# EAGLE schematic smrf-v1.0.1b (EAGLE 7.3.0)

## Sheet 1 of 6
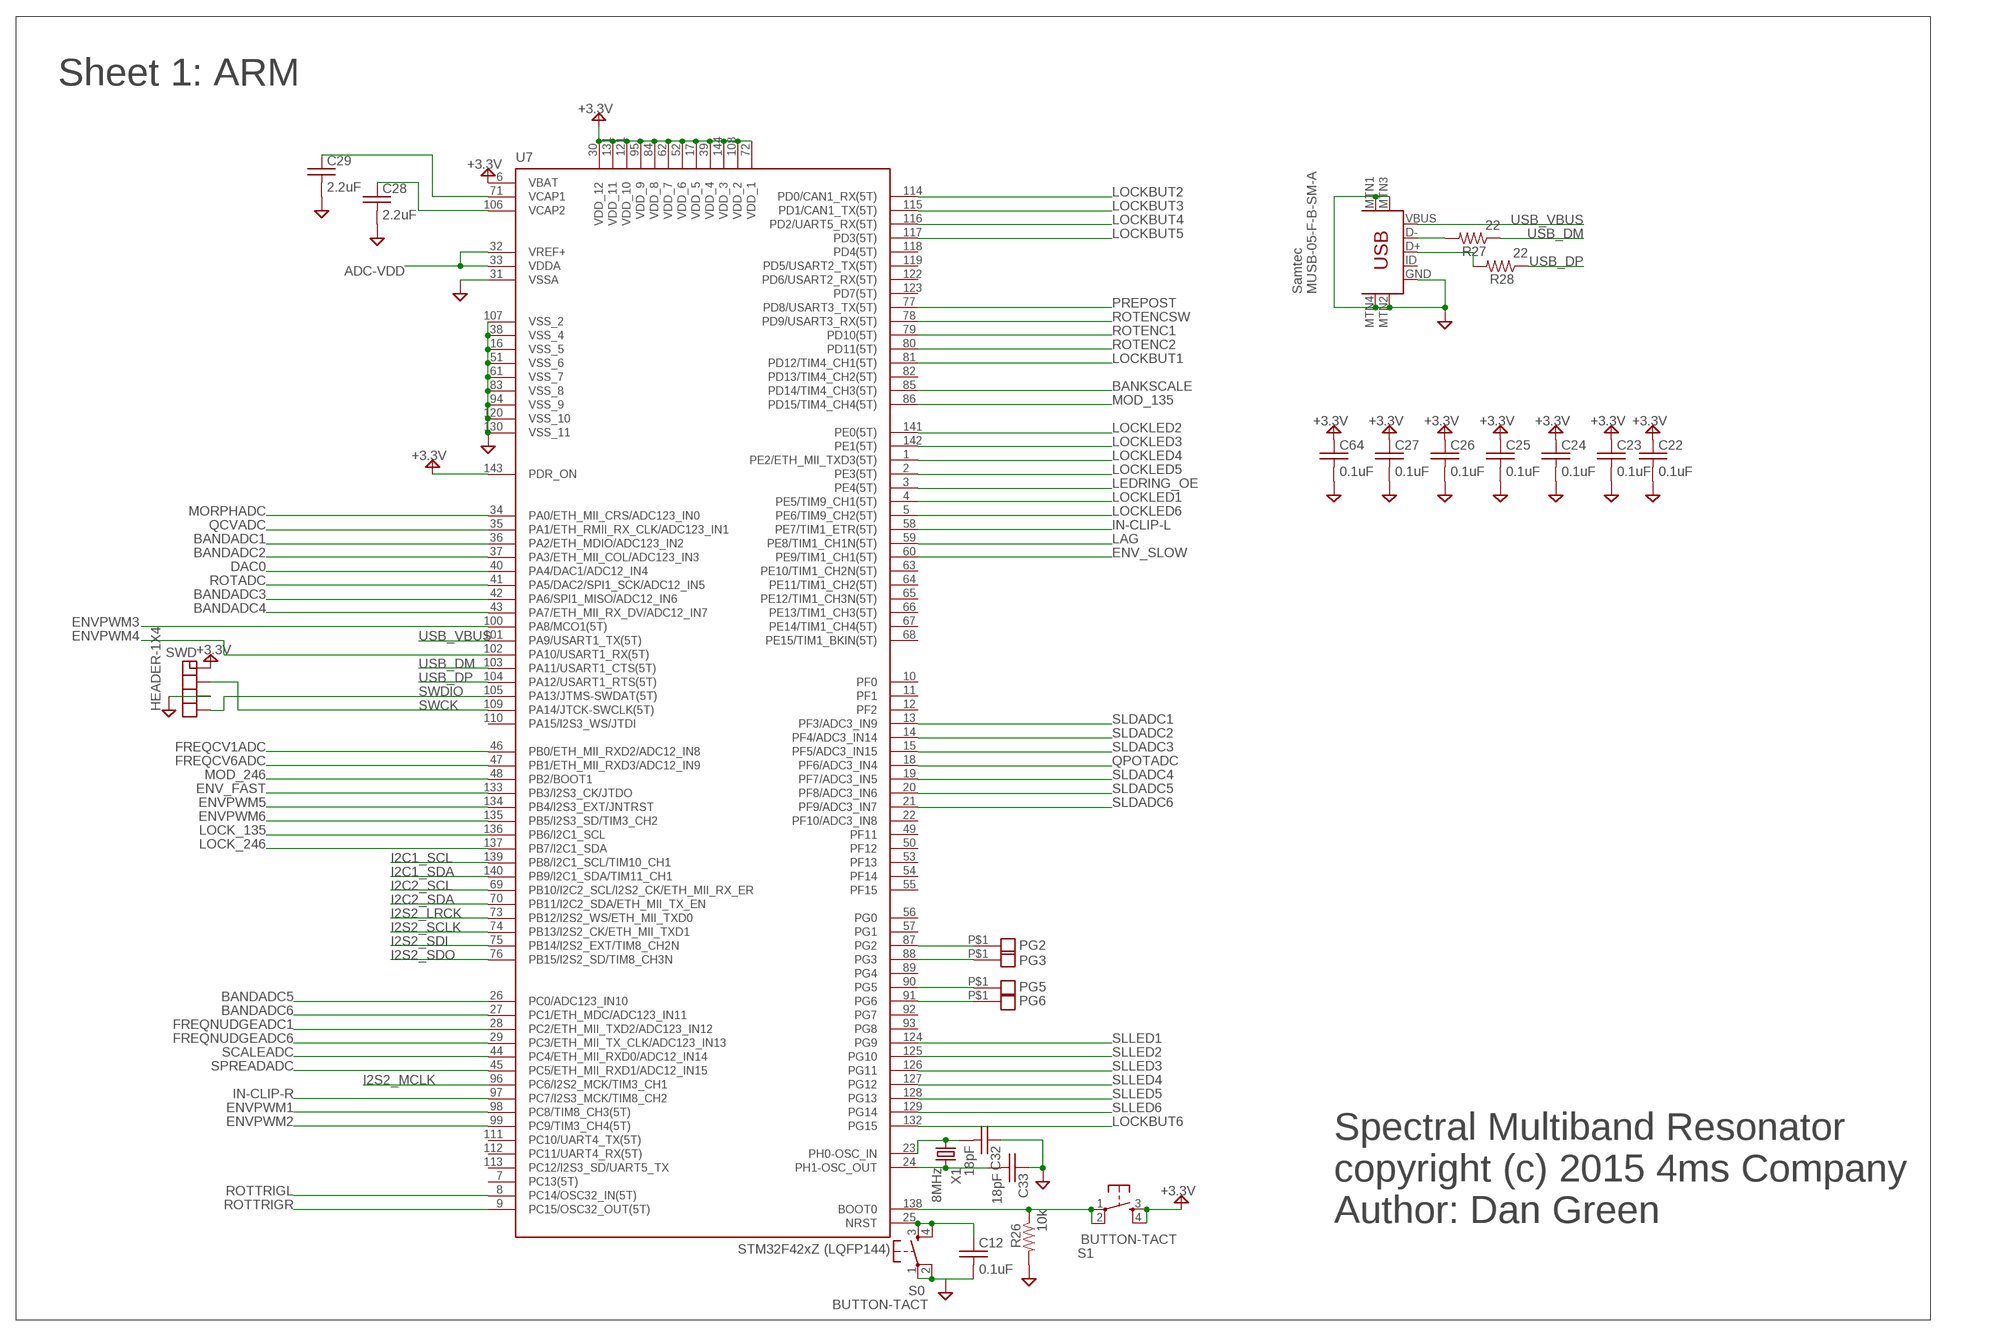
[diagram p0: schematic, sheet 1]

### Parts
C12  0.1uF  CB  [C0603]
C22  0.1uF  CB  [C0603]
C23  0.1uF  CB  [C0603]
C24  0.1uF  CB  [C0603]
C25  0.1uF  CB  [C0603]
C26  0.1uF  CB  [C0603]
C27  0.1uF  CB  [C0603]
C28  2.2uF  CB  [C0603]
C29  2.2uF  CB  [C0603]
C32  18pF  CB  [C0603]
C33  18pF  CB  [C0603]
C64  0.1uF  CB  [C0603]
PG2  PAD-06  [PAD-06]
PG3  PAD-06  [PAD-06]
PG5  PAD-06  [PAD-06]
PG6  PAD-06  [PAD-06]
R26  10k  RB  [R0603]
R27  22  RB  [R0603]
R28  22  RB  [R0603]
S0  BUTTON-TACT  [BUTTON-TACT-SKQG]
S1  BUTTON-TACT  [BUTTON-TACT-SKQG]
SWD  HEADER-1X4  [HEADER-1X4-TH]
U7  STM32F427ZG  STM32F429ZI  [LQFP144]
U$1  USB-MINIB-5PIN  [USB-MINIB]
X1  8MHz  CRYSTALD  [HC-49/US]

### Nets
+3.3V [power]: C22.1 C23.1 C24.1 C25.1 C26.1 C27.1 C64.1 S1.3 S1.4 SWD.P$1 U7.6(VBAT) U7.17(VDD_5) U7.30(VDD_12) U7.39(VDD_4) U7.52(VDD_6) U7.62(VDD_7) U7.72(VDD_1) U7.84(VDD_8) U7.95(VDD_9) U7.108(VDD_2) U7.121(VDD_10) U7.131(VDD_11) U7.143(PDR_ON) U7.144(VDD_3) ; also sheet 2,4,6
ADC-VDD [power]: U7.32(VREF+) U7.33(VDDA) ; also sheet 3,4,6
BANDADC1: U7.36(PA2/ETH_MDIO/ADC123_IN2) ; also sheet 3
BANDADC2: U7.37(PA3/ETH_MII_COL/ADC123_IN3) ; also sheet 3
BANDADC3: U7.42(PA6/SPI1_MISO/ADC12_IN6) ; also sheet 3
BANDADC4: U7.43(PA7/ETH_MII_RX_DV/ADC12_IN7) ; also sheet 3
BANDADC5: U7.26(PC0/ADC123_IN10) ; also sheet 3
BANDADC6: U7.27(PC1/ETH_MDC/ADC123_IN11) ; also sheet 3
BANKSCALE: U7.85(PD14/TIM4_CH3(5T)) ; also sheet 4
DAC0: U7.40(PA4/DAC1/ADC12_IN4) ; also sheet 2
ENV_FAST: U7.133(PB3/I2S3_CK/JTDO) ; also sheet 4
ENV_SLOW: U7.60(PE9/TIM1_CH1(5T)) ; also sheet 4
ENVPWM1: U7.98(PC8/TIM8_CH3(5T)) ; also sheet 3
ENVPWM2: U7.99(PC9/TIM3_CH4(5T)) ; also sheet 3
ENVPWM3: U7.100(PA8/MCO1(5T)) ; also sheet 3
ENVPWM4: U7.102(PA10/USART1_RX(5T)) ; also sheet 3
ENVPWM5: U7.134(PB4/I2S3_EXT/JNTRST) ; also sheet 3
ENVPWM6: U7.135(PB5/I2S3_SD/TIM3_CH2) ; also sheet 3
FREQCV1ADC: U7.46(PB0/ETH_MII_RXD2/ADC12_IN8) ; also sheet 4
FREQCV6ADC: U7.47(PB1/ETH_MII_RXD3/ADC12_IN9) ; also sheet 4
FREQNUDGEADC1: U7.28(PC2/ETH_MII_TXD2/ADC123_IN12) ; also sheet 4
FREQNUDGEADC6: U7.29(PC3/ETH_MII_TX_CLK/ADC123_IN13) ; also sheet 4
GND [power]: C12.2 C22.2 C23.2 C24.2 C25.2 C26.2 C27.2 C28.2 C29.2 C32.1 C33.1 C64.2 R26.2 S0.1 S0.2 SWD.P$3 U7.16(VSS_5) U7.31(VSSA) U7.38(VSS_4) U7.51(VSS_6) U7.61(VSS_7) U7.83(VSS_8) U7.94(VSS_9) U7.107(VSS_2) U7.120(VSS_10) U7.130(VSS_11) U$1.GND U$1.MTN1(MTN2) U$1.MTN2(MTN3) U$1.MTN3(MTN1) U$1.MTN4 ; also sheet 2,3,4,5,6
I2C1_SCL: U7.139(PB8/I2C1_SCL/TIM10_CH1) ; also sheet 5
I2C1_SDA: U7.140(PB9/I2C1_SDA/TIM11_CH1) ; also sheet 5
I2C2_SCL: U7.69(PB10/I2C2_SCL/I2S2_CK/ETH_MII_RX_ER) ; also sheet 2
I2C2_SDA: U7.70(PB11/I2C2_SDA/ETH_MII_TX_EN) ; also sheet 2
I2S2_LRCK: U7.73(PB12/I2S2_WS/ETH_MII_TXD0) ; also sheet 2
I2S2_MCLK: U7.96(PC6/I2S2_MCK/TIM3_CH1) ; also sheet 2
I2S2_SCLK: U7.74(PB13/I2S2_CK/ETH_MII_TXD1) ; also sheet 2
I2S2_SDI: U7.75(PB14/I2S2_EXT/TIM8_CH2N) ; also sheet 2
I2S2_SDO: U7.76(PB15/I2S2_SD/TIM8_CH3N) ; also sheet 2
IN-CLIP-L: U7.58(PE7/TIM1_ETR(5T)) ; also sheet 4
IN-CLIP-R: U7.97(PC7/I2S3_MCK/TIM8_CH2) ; also sheet 4
LAG: U7.59(PE8/TIM1_CH1N(5T)) ; also sheet 4
LEDRING_OE: U7.3(PE4(5T)) ; also sheet 5
LOCK_135: U7.136(PB6/I2C1_SCL) ; also sheet 4
LOCK_246: U7.137(PB7/I2C1_SDA) ; also sheet 4
LOCKBUT1: U7.81(PD12/TIM4_CH1(5T)) ; also sheet 3
LOCKBUT2: U7.114(PD0/CAN1_RX(5T)) ; also sheet 3
LOCKBUT3: U7.115(PD1/CAN1_TX(5T)) ; also sheet 3
LOCKBUT4: U7.116(PD2/UART5_RX(5T)) ; also sheet 3
LOCKBUT5: U7.117(PD3(5T)) ; also sheet 3
LOCKBUT6: U7.132(PG15) ; also sheet 3
LOCKLED1: U7.4(PE5/TIM9_CH1(5T)) ; also sheet 3
LOCKLED2: U7.141(PE0(5T)) ; also sheet 3
LOCKLED3: U7.142(PE1(5T)) ; also sheet 3
LOCKLED4: U7.1(PE2/ETH_MII_TXD3(5T)) ; also sheet 3
LOCKLED5: U7.2(PE3(5T)) ; also sheet 3
LOCKLED6: U7.5(PE6/TIM9_CH2(5T)) ; also sheet 3
MOD_135: U7.86(PD15/TIM4_CH4(5T)) ; also sheet 4
MOD_246: U7.48(PB2/BOOT1) ; also sheet 4
MORPHADC: U7.34(PA0/ETH_MII_CRS/ADC123_IN0) ; also sheet 4
N$12: R27.2 U$1.D-
N$13: R28.2 U$1.D+
N$14: C32.2 U7.23(PH0-OSC_IN) X1.1
N$38: C28.1 U7.106(VCAP2)
N$39: C29.1 U7.71(VCAP1)
N$40: R26.1 S1.1 S1.2 U7.138(BOOT0)
N$41: C33.2 U7.24(PH1-OSC_OUT) X1.2
N$53: PG2.P$1 U7.87(PG2)
N$96: PG3.P$1 U7.88(PG3)
N$223: PG6.P$1 U7.91(PG6)
N$224: PG5.P$1 U7.90(PG5)
NRST: C12.1 S0.3 S0.4 U7.25(NRST)
PREPOST: U7.77(PD8/USART3_TX(5T)) ; also sheet 4
QCVADC: U7.35(PA1/ETH_RMII_RX_CLK/ADC123_IN1) ; also sheet 4
QPOTADC: U7.18(PF6/ADC3_IN4) ; also sheet 4
ROTADC: U7.41(PA5/DAC2/SPI1_SCK/ADC12_IN5) ; also sheet 4
ROTENC1: U7.79(PD10(5T)) ; also sheet 4
ROTENC2: U7.80(PD11(5T)) ; also sheet 4
ROTENCSW: U7.78(PD9/USART3_RX(5T)) ; also sheet 4
ROTTRIGL: U7.8(PC14/OSC32_IN(5T)) ; also sheet 4
ROTTRIGR: U7.9(PC15/OSC32_OUT(5T)) ; also sheet 4
SCALEADC: U7.44(PC4/ETH_MII_RXD0/ADC12_IN14) ; also sheet 4
SLDADC1: U7.13(PF3/ADC3_IN9) ; also sheet 3
SLDADC2: U7.14(PF4/ADC3_IN14) ; also sheet 3
SLDADC3: U7.15(PF5/ADC3_IN15) ; also sheet 3
SLDADC4: U7.19(PF7/ADC3_IN5) ; also sheet 3
SLDADC5: U7.20(PF8/ADC3_IN6) ; also sheet 3
SLDADC6: U7.21(PF9/ADC3_IN7) ; also sheet 3
SLLED1: U7.124(PG9) ; also sheet 3
SLLED2: U7.125(PG10) ; also sheet 3
SLLED3: U7.126(PG11) ; also sheet 3
SLLED4: U7.127(PG12) ; also sheet 3
SLLED5: U7.128(PG13) ; also sheet 3
SLLED6: U7.129(PG14) ; also sheet 3
SPREADADC: U7.45(PC5/ETH_MII_RXD1/ADC12_IN15) ; also sheet 4
SWCK: SWD.P$2 U7.109(PA14/JTCK-SWCLK(5T))
SWDIO: SWD.P$4 U7.105(PA13/JTMS-SWDAT(5T))
USB_DM: R27.1 U7.103(PA11/USART1_CTS(5T))
USB_DP: R28.1 U7.104(PA12/USART1_RTS(5T))
USB_VBUS: U7.101(PA9/USART1_TX(5T)) U$1.VBUS
Unconnected: U7.7(PC13(5T)) U7.10(PF0) U7.11(PF1) U7.12(PF2) U7.22(PF10/ADC3_IN8) U7.49(PF11) U7.50(PF12) U7.53(PF13) U7.54(PF14) U7.55(PF15) U7.56(PG0) U7.57(PG1) U7.63(PE10/TIM1_CH2N(5T)) U7.64(PE11/TIM1_CH2(5T)) U7.65(PE12/TIM1_CH3N(5T)) U7.66(PE13/TIM1_CH3(5T)) U7.67(PE14/TIM1_CH4(5T)) U7.68(PE15/TIM1_BKIN(5T)) U7.82(PD13/TIM4_CH2(5T)) U7.89(PG4) U7.92(PG7) U7.93(PG8) U7.110(PA15/I2S3_WS/JTDI) U7.111(PC10/UART4_TX(5T)) U7.112(PC11/UART4_RX(5T)) U7.113(PC12/I2S3_SD/UART5_TX) U7.118(PD4(5T)) U7.119(PD5/USART2_TX(5T)) U7.122(PD6/USART2_RX(5T)) U7.123(PD7(5T)) U$1.ID

### Notes on the sheet
- Sheet 1: ARM
- Samtec 
  MUSB-05-F-B-SM-A
- Spectral Multiband Resonator
- copyright (c) 2015 4ms Company
  Author: Dan Green

## Sheet 2 of 6
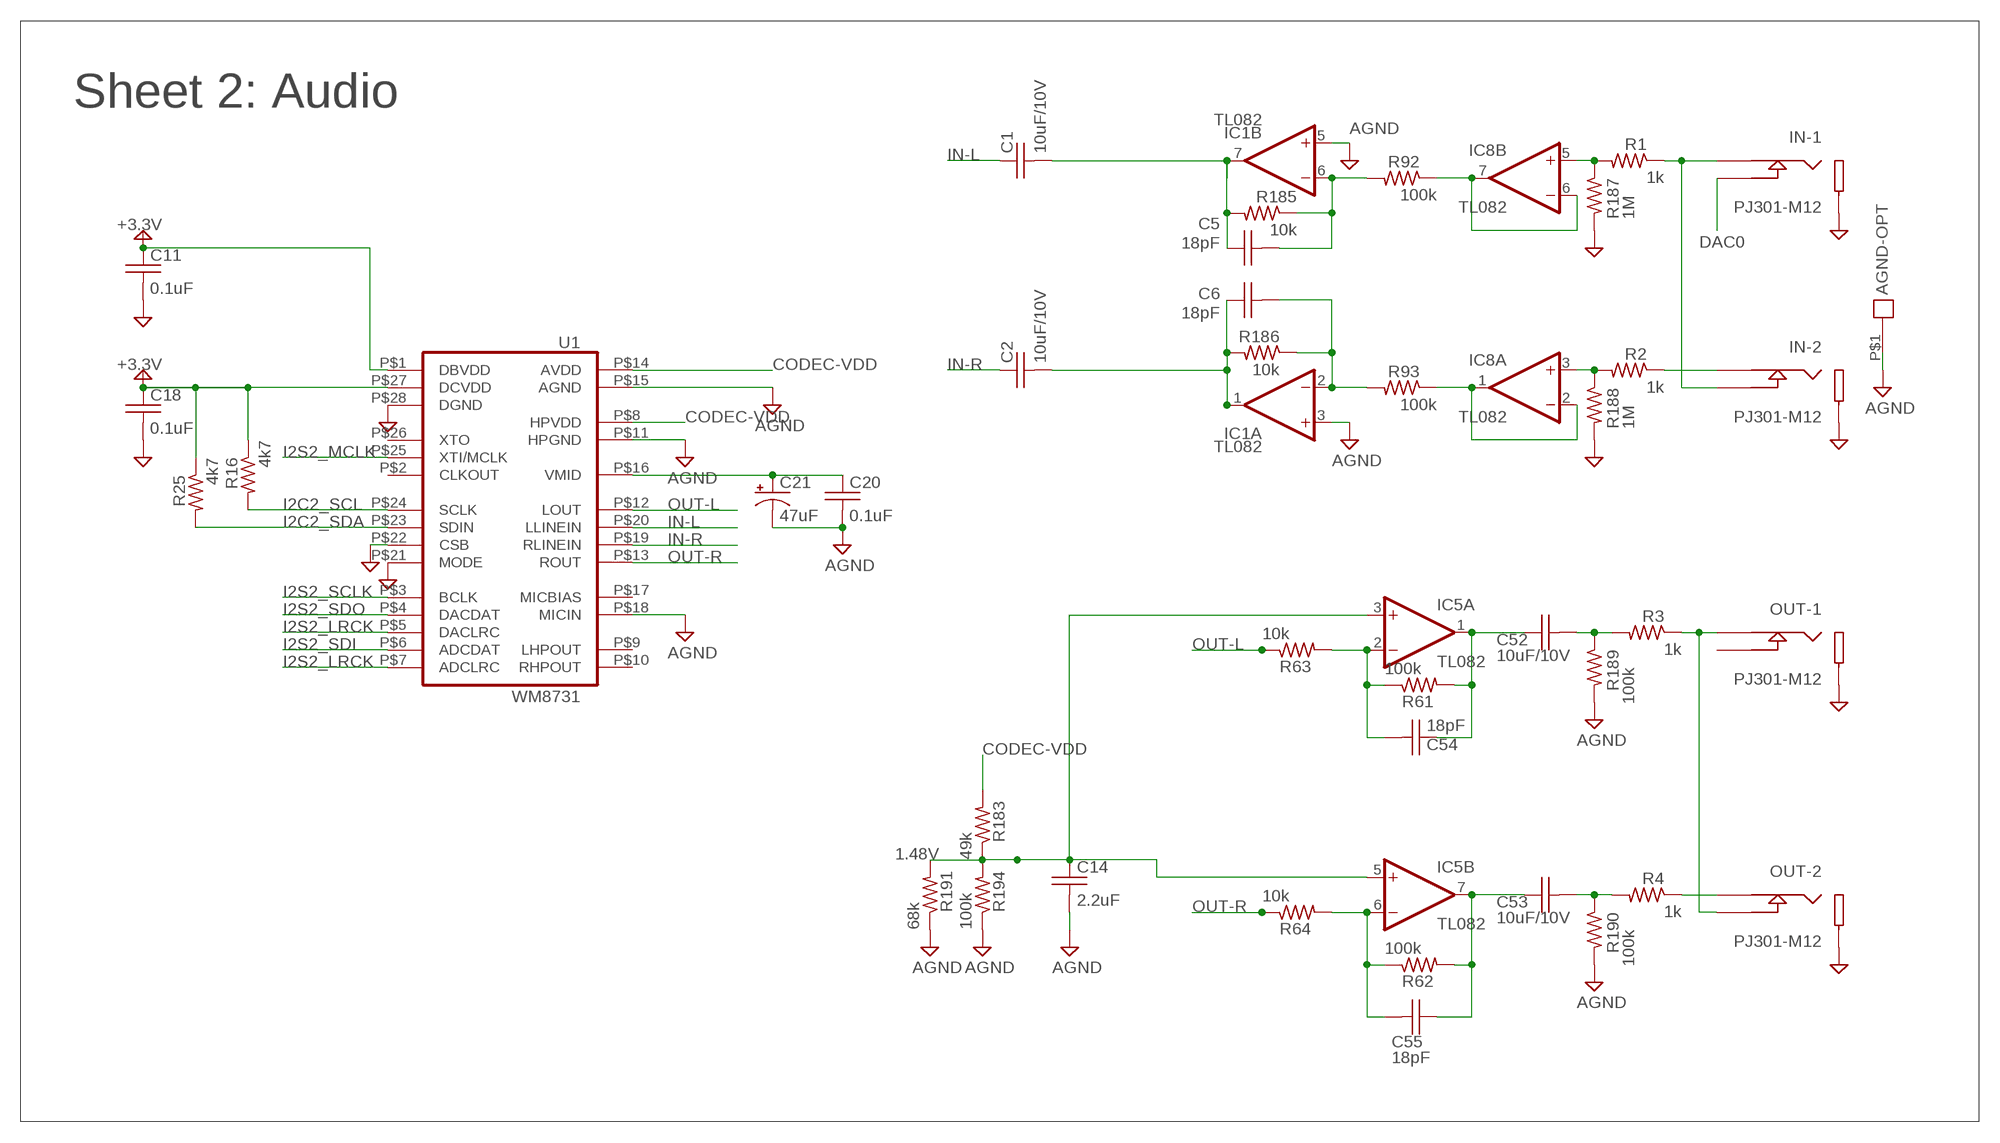
[diagram p1: schematic, sheet 2]

### Parts
AGND-OPT  PAD-06  [PAD-06]
C1  10uF/10V  CB  [C0603]
C2  10uF/10V  CB  [C0603]
C5  18pF  CB  [C0603]
C6  18pF  CB  [C0603]
C11  0.1uF  CB  [C0603]
C14  2.2uF  CB  [C0603]
C18  0.1uF  CB  [C0603]
C20  0.1uF  CB  [C0603]
C21  47uF  C-POL5  [C-POL-5]
C52  10uF/10V  CB  [C0603]
C53  10uF/10V  CB  [C0603]
C54  18pF  CB  [C0603]
C55  18pF  CB  [C0603]
IC1  TL082  OPAMP-2TL072T  [TSSOP8]
IC5  TL082  OPAMP-2TL072T  [TSSOP8]
IC8  TL082  OPAMP-2TL072T  [TSSOP8]
IN-1  PJ301-M12  JACK-MONO-SWM2  [PJ301M-12-FIX]
IN-2  PJ301-M12  JACK-MONO-SWM2  [PJ301M-12-FIX]
OUT-1  PJ301-M12  JACK-MONO-SWM2  [PJ301M-12-FIX]
OUT-2  PJ301-M12  JACK-MONO-SWM2  [PJ301M-12-FIX]
R1  1k  RB  [R0603]
R2  1k  RB  [R0603]
R3  1k  RB  [R0603]
R4  1k  RB  [R0603]
R16  4k7  RB  [R0603]
R25  4k7  RB  [R0603]
R61  100k  RB  [R0603]
R62  100k  RB  [R0603]
R63  10k  RB  [R0603]
R64  10k  RB  [R0603]
R92  100k  RB  [R0603]
R93  100k  RB  [R0603]
R183  49k  RB  [R0603]
R185  10k  RB  [R0603]
R186  10k  RB  [R0603]
R187  1M  RB  [R0603]
R188  1M  RB  [R0603]
R189  100k  RB  [R0603]
R190  100k  RB  [R0603]
R191  68k  RB  [R0603]
R194  100k  RB  [R0603]
U1  WM8731  [28-SSOP]

### Nets
+3.3V [power]: C11.1 C18.1 R16.1 R25.1 U1.P$1(DBVDD) U1.P$27(DCVDD) ; also sheet 1,4,6
AGND: AGND-OPT.P$1 C14.2 C20.2 C21.- IC1.3(A:+IN) IC1.5(B:+IN) R189.2 R190.2 R191.1 R194.1 U1.P$11(HPGND) U1.P$15(AGND) U1.P$18(MICIN) ; also sheet 6
CODEC-VDD [power]: R183.2 U1.P$8(HPVDD) U1.P$14(AVDD) ; also sheet 6
DAC0: IN-1.3(TIP-SW) ; also sheet 1
GND [power]: C11.2 C18.2 IN-1.2(SLEEVE) IN-2.2(SLEEVE) OUT-1.2(SLEEVE) OUT-2.2(SLEEVE) R187.2 R188.2 U1.P$21(MODE) U1.P$22(CSB) U1.P$28(DGND) ; supply symbol labelled BANDV1 ; also sheet 1,3,4,5,6
I2C2_SCL: R16.2 U1.P$24(SCLK) ; also sheet 1
I2C2_SDA: R25.2 U1.P$23(SDIN) ; also sheet 1
I2S2_LRCK: U1.P$5(DACLRC) U1.P$7(ADCLRC) ; also sheet 1
I2S2_MCLK: U1.P$25(XTI/MCLK) ; also sheet 1
I2S2_SCLK: U1.P$3(BCLK) ; also sheet 1
I2S2_SDI: U1.P$6(ADCDAT) ; also sheet 1
I2S2_SDO: U1.P$4(DACDAT) ; also sheet 1
IN-L: C1.1 U1.P$20(LLINEIN)
IN-R: C2.1 U1.P$19(RLINEIN)
N$7: OUT-2.1(TIP) R4.1
N$8: OUT-1.1(TIP) OUT-2.3(TIP-SW) R3.1
N$9: IN-2.1(TIP) R2.1
N$10: C6.2 IC1.2(A:-IN) R93.2 R186.1
N$19: C20.1 C21.+ U1.P$16(VMID)
N$28: C54.2 IC5.2(A:-IN) R61.1 R63.2
N$117: C5.2 IC1.6(B:-IN) R92.2 R185.1
N$118: IN-1.1(TIP) IN-2.3(TIP-SW) R1.1
N$120: C1.2 C5.1 IC1.7(B:OUT) R185.2
N$122: C2.2 C6.1 IC1.1(A:OUT) R186.2
N$144: C52.1 C54.1 IC5.1(A:OUT) R61.2
N$145: C55.2 IC5.6(B:-IN) R62.1 R64.2
N$146: C53.1 C55.1 IC5.7(B:OUT) R62.2
N$195: IC8.5(B:+IN) R1.2 R187.1
N$211: IC8.3(A:+IN) R2.2 R188.1
N$212: IC8.6(B:-IN) IC8.7(B:OUT) R92.1
N$213: IC8.1(A:OUT) IC8.2(A:-IN) R93.1
N$282: C52.2 R3.2 R189.1
N$283: C53.2 R4.2 R190.1
OUT-L: R63.1 U1.P$12(LOUT)
OUT-R: R64.1 U1.P$13(ROUT)
VOUTOFFSET [power]: C14.1 IC5.3(A:+IN) IC5.5(B:+IN) R183.1 R191.2 R194.2
Unconnected: OUT-1.3(TIP-SW) U1.P$2(CLKOUT) U1.P$9(LHPOUT) U1.P$10(RHPOUT) U1.P$17(MICBIAS) U1.P$26(XTO)

### Notes on the sheet
- Sheet 2: Audio
- 1.48V

## Sheet 3 of 6
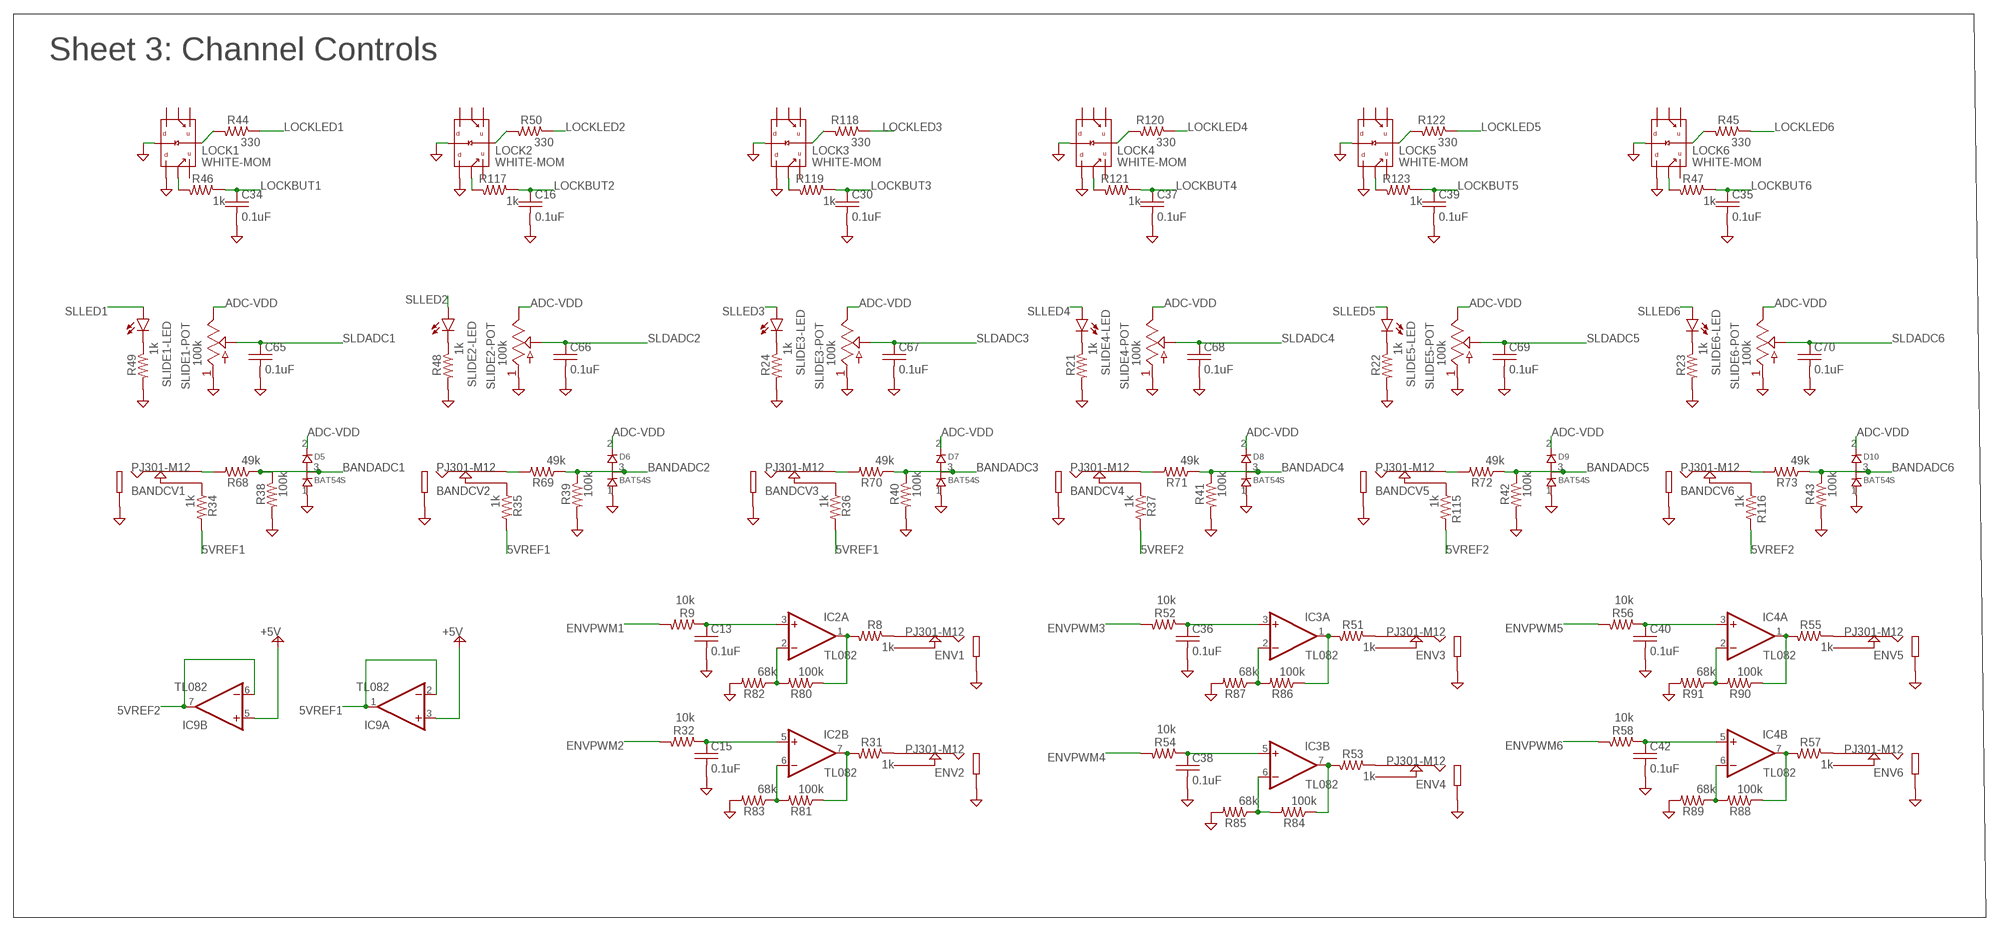
[diagram p2: schematic, sheet 3]

### Parts
BANDCV1  PJ301-M12  JACK-MONO-SWM2  [PJ301M-12-FIX]
BANDCV2  PJ301-M12  JACK-MONO-SWM2  [PJ301M-12-FIX]
BANDCV3  PJ301-M12  JACK-MONO-SWM2  [PJ301M-12-FIX]
BANDCV4  PJ301-M12  JACK-MONO-SWM2  [PJ301M-12-FIX]
BANDCV5  PJ301-M12  JACK-MONO-SWM2  [PJ301M-12-FIX]
BANDCV6  PJ301-M12  JACK-MONO-SWM2  [PJ301M-12-FIX]
C13  0.1uF  CB  [C0603]
C15  0.1uF  CB  [C0603]
C16  0.1uF  CB  [C0603]
C30  0.1uF  CB  [C0603]
C34  0.1uF  CB  [C0603]
C35  0.1uF  CB  [C0603]
C36  0.1uF  CB  [C0603]
C37  0.1uF  CB  [C0603]
C38  0.1uF  CB  [C0603]
C39  0.1uF  CB  [C0603]
C40  0.1uF  CB  [C0603]
C42  0.1uF  CB  [C0603]
C65  0.1uF  CB  [C0603]
C66  0.1uF  CB  [C0603]
C67  0.1uF  CB  [C0603]
C68  0.1uF  CB  [C0603]
C69  0.1uF  CB  [C0603]
C70  0.1uF  CB  [C0603]
D5  BAT54S  DIODE-DUAL  [SOT23]
D6  BAT54S  DIODE-DUAL  [SOT23]
D7  BAT54S  DIODE-DUAL  [SOT23]
D8  BAT54S  DIODE-DUAL  [SOT23]
D9  BAT54S  DIODE-DUAL  [SOT23]
D10  BAT54S  DIODE-DUAL  [SOT23]
ENV1  PJ301-M12  JACK-MONO-SWM2  [PJ301M-12-FIX]
ENV2  PJ301-M12  JACK-MONO-SWM2  [PJ301M-12-FIX]
ENV3  PJ301-M12  JACK-MONO-SWM2  [PJ301M-12-FIX]
ENV4  PJ301-M12  JACK-MONO-SWM2  [PJ301M-12-FIX]
ENV5  PJ301-M12  JACK-MONO-SWM2  [PJ301M-12-FIX]
ENV6  PJ301-M12  JACK-MONO-SWM2  [PJ301M-12-FIX]
IC2  TL082  OPAMP-2TL072T  [TSSOP8]
IC3  TL082  OPAMP-2TL072T  [TSSOP8]
IC4  TL082  OPAMP-2TL072T  [TSSOP8]
IC9  TL082  OPAMP-2TL072T  [TSSOP8]
LOCK1  WHITE-MOM  BUTTON-LED  [BUTTON-LED-PB61303]
LOCK2  WHITE-MOM  BUTTON-LED  [BUTTON-LED-PB61303]
LOCK3  WHITE-MOM  BUTTON-LED  [BUTTON-LED-PB61303]
LOCK4  WHITE-MOM  BUTTON-LED  [BUTTON-LED-PB61303]
LOCK5  WHITE-MOM  BUTTON-LED  [BUTTON-LED-PB61303]
LOCK6  WHITE-MOM  BUTTON-LED  [BUTTON-LED-PB61303]
R8  1k  RB  [R0603]
R9  10k  RB  [R0603]
R21  1k  RB  [R0603]
R22  1k  RB  [R0603]
R23  1k  RB  [R0603]
R24  1k  RB  [R0603]
R31  1k  RB  [R0603]
R32  10k  RB  [R0603]
R34  1k  RB  [R0603]
R35  1k  RB  [R0603]
R36  1k  RB  [R0603]
R37  1k  RB  [R0603]
R38  100k  RB  [R0603]
R39  100k  RB  [R0603]
R40  100k  RB  [R0603]
R41  100k  RB  [R0603]
R42  100k  RB  [R0603]
R43  100k  RB  [R0603]
R44  330  RB  [R0603]
R45  330  RB  [R0603]
R46  1k  RB  [R0603]
R47  1k  RB  [R0603]
R48  1k  RB  [R0603]
R49  1k  RB  [R0603]
R50  330  RB  [R0603]
R51  1k  RB  [R0603]
R52  10k  RB  [R0603]
R53  1k  RB  [R0603]
R54  10k  RB  [R0603]
R55  1k  RB  [R0603]
R56  10k  RB  [R0603]
R57  1k  RB  [R0603]
R58  10k  RB  [R0603]
R68  49k  RB  [R0603]
R69  49k  RB  [R0603]
R70  49k  RB  [R0603]
R71  49k  RB  [R0603]
R72  49k  RB  [R0603]
R73  49k  RB  [R0603]
R80  100k  RB  [R0603]
R81  100k  RB  [R0603]
R82  68k  RB  [R0603]
R83  68k  RB  [R0603]
R84  100k  RB  [R0603]
R85  68k  RB  [R0603]
R86  100k  RB  [R0603]
R87  68k  RB  [R0603]
R88  100k  RB  [R0603]
R89  68k  RB  [R0603]
R90  100k  RB  [R0603]
R91  68k  RB  [R0603]
R115  1k  RB  [R0603]
R116  1k  RB  [R0603]
R117  1k  RB  [R0603]
R118  330  RB  [R0603]
R119  1k  RB  [R0603]
R120  330  RB  [R0603]
R121  1k  RB  [R0603]
R122  330  RB  [R0603]
R123  1k  RB  [R0603]
SLIDE1  100k  POT-LED  [POT-SLIDER-ALPHA-RA2045F-20]
SLIDE2  100k  POT-LED  [POT-SLIDER-ALPHA-RA2045F-20]
SLIDE3  100k  POT-LED  [POT-SLIDER-ALPHA-RA2045F-20]
SLIDE4  100k  POT-LED  [POT-SLIDER-ALPHA-RA2045F-20]
SLIDE5  100k  POT-LED  [POT-SLIDER-ALPHA-RA2045F-20]
SLIDE6  100k  POT-LED  [POT-SLIDER-ALPHA-RA2045F-20]

### Nets
5VREF1: IC9.1(A:OUT) IC9.2(A:-IN) R34.2 R35.2 R36.2
5VREF2: IC9.6(B:-IN) IC9.7(B:OUT) R37.2 R115.2 R116.2
+5V [power]: IC9.3(A:+IN) IC9.5(B:+IN) ; also sheet 4,6
ADC-VDD [power]: D5.2(CATHODE) D6.2(CATHODE) D7.2(CATHODE) D8.2(CATHODE) D9.2(CATHODE) D10.2(CATHODE) SLIDE1.P$3 SLIDE2.P$3 SLIDE3.P$3 SLIDE4.P$3 SLIDE5.P$3 SLIDE6.P$3 ; also sheet 1,4,6
BANDADC1: D5.3(COMMON) R38.1 R68.1 ; also sheet 1
BANDADC2: D6.3(COMMON) R39.1 R69.1 ; also sheet 1
BANDADC3: D7.3(COMMON) R40.1 R70.1 ; also sheet 1
BANDADC4: D8.3(COMMON) R41.1 R71.1 ; also sheet 1
BANDADC5: D9.3(COMMON) R42.1 R72.1 ; also sheet 1
BANDADC6: D10.3(COMMON) R43.1 R73.1 ; also sheet 1
ENVPWM1: R9.2 ; also sheet 1
ENVPWM2: R32.2 ; also sheet 1
ENVPWM3: R52.2 ; also sheet 1
ENVPWM4: R54.2 ; also sheet 1
ENVPWM5: R56.2 ; also sheet 1
ENVPWM6: R58.2 ; also sheet 1
GND [power]: BANDCV1.2(SLEEVE) BANDCV2.2(SLEEVE) BANDCV3.2(SLEEVE) BANDCV4.2(SLEEVE) BANDCV5.2(SLEEVE) BANDCV6.2(SLEEVE) C13.2 C15.2 C16.2 C30.2 C34.2 C35.2 C36.2 C37.2 C38.2 C39.2 C40.2 C42.2 C65.2 C66.2 C67.2 C68.2 C69.2 C70.2 D5.1(ANODE) D6.1(ANODE) D7.1(ANODE) D8.1(ANODE) D9.1(ANODE) D10.1(ANODE) ENV1.2(SLEEVE) ENV2.2(SLEEVE) ENV3.2(SLEEVE) ENV4.2(SLEEVE) ENV5.2(SLEEVE) ENV6.2(SLEEVE) LOCK1.P$6 LOCK1.P$8 LOCK2.P$6 LOCK2.P$8 LOCK3.P$6 LOCK3.P$8 LOCK4.P$6 LOCK4.P$8 LOCK5.P$6 LOCK5.P$8 LOCK6.P$6 LOCK6.P$8 R21.2 R22.2 R23.2 R24.2 R38.2 R39.2 R40.2 R41.2 R42.2 R43.2 R48.2 R49.2 R82.2 R83.2 R85.2 R87.2 R89.2 R91.2 SLIDE1.P$1 SLIDE2.P$1 SLIDE3.P$1 SLIDE4.P$1 SLIDE5.P$1 SLIDE6.P$1 ; supply symbol labelled BANDV1 ; also sheet 1,2,4,5,6
LOCKBUT1: C34.1 R46.1 ; also sheet 1
LOCKBUT2: C16.1 R117.1 ; also sheet 1
LOCKBUT3: C30.1 R119.1 ; also sheet 1
LOCKBUT4: C37.1 R121.1 ; also sheet 1
LOCKBUT5: C39.1 R123.1 ; also sheet 1
LOCKBUT6: C35.1 R47.1 ; also sheet 1
LOCKLED1: R44.1 ; also sheet 1
LOCKLED2: R50.1 ; also sheet 1
LOCKLED3: R118.1 ; also sheet 1
LOCKLED4: R120.1 ; also sheet 1
LOCKLED5: R122.1 ; also sheet 1
LOCKLED6: R45.1 ; also sheet 1
N$4: ENV1.1(TIP) R8.1
N$29: BANDCV1.3(TIP-SW) R34.1
N$30: BANDCV2.3(TIP-SW) R35.1
N$31: BANDCV3.3(TIP-SW) R36.1
N$32: BANDCV4.3(TIP-SW) R37.1
N$33: BANDCV5.3(TIP-SW) R115.1
N$34: BANDCV6.3(TIP-SW) R116.1
N$35: R21.1 SLIDE4.P$LEDC(-LED:C)
N$36: R22.1 SLIDE5.P$LEDC(-LED:C)
N$37: LOCK2.P$7 R50.2
N$69: LOCK2.P$5 R117.2
N$102: C13.1 IC2.3(A:+IN) R9.1
N$104: R23.1 SLIDE6.P$LEDC(-LED:C)
N$105: BANDCV1.1(TIP) R68.2
N$106: LOCK1.P$7 R44.2
N$107: BANDCV2.1(TIP) R69.2
N$108: LOCK6.P$7 R45.2
N$109: R24.1 SLIDE3.P$LEDC(-LED:C)
N$110: BANDCV3.1(TIP) R70.2
N$111: LOCK1.P$5 R46.2
N$112: R48.1 SLIDE2.P$LEDC(-LED:C)
N$113: BANDCV4.1(TIP) R71.2
N$114: LOCK6.P$5 R47.2
N$115: R49.1 SLIDE1.P$LEDC(-LED:C)
N$116: BANDCV5.1(TIP) R72.2
N$119: BANDCV6.1(TIP) R73.2
N$121: IC2.1(A:OUT) R8.2 R80.1
N$123: ENV2.1(TIP) R31.1
N$124: C15.1 IC2.5(B:+IN) R32.1
N$126: IC2.7(B:OUT) R31.2 R81.1
N$127: ENV3.1(TIP) R51.1
N$128: C36.1 IC3.3(A:+IN) R52.1
N$130: IC3.1(A:OUT) R51.2 R86.1
N$131: ENV4.1(TIP) R53.1
N$132: C38.1 IC3.5(B:+IN) R54.1
N$134: IC3.7(B:OUT) R53.2 R84.1
N$135: ENV5.1(TIP) R55.1
N$136: C40.1 IC4.3(A:+IN) R56.1
N$138: IC4.1(A:OUT) R55.2 R90.1
N$139: ENV6.1(TIP) R57.1
N$140: C42.1 IC4.5(B:+IN) R58.1
N$141: IC4.7(B:OUT) R57.2 R88.1
N$189: IC4.2(A:-IN) R90.2 R91.1
N$190: IC3.6(B:-IN) R84.2 R85.1
N$191: IC3.2(A:-IN) R86.2 R87.1
N$192: IC4.6(B:-IN) R88.2 R89.1
N$193: IC2.6(B:-IN) R81.2 R83.1
N$194: IC2.2(A:-IN) R80.2 R82.1
N$214: LOCK3.P$7 R118.2
N$215: LOCK3.P$5 R119.2
N$216: LOCK4.P$7 R120.2
N$217: LOCK4.P$5 R121.2
N$218: LOCK5.P$7 R122.2
N$219: LOCK5.P$5 R123.2
SLDADC1: C65.1 SLIDE1.P$2 ; also sheet 1
SLDADC2: C66.1 SLIDE2.P$2 ; also sheet 1
SLDADC3: C67.1 SLIDE3.P$2 ; also sheet 1
SLDADC4: C68.1 SLIDE4.P$2 ; also sheet 1
SLDADC5: C69.1 SLIDE5.P$2 ; also sheet 1
SLDADC6: C70.1 SLIDE6.P$2 ; also sheet 1
SLLED1: SLIDE1.P$LEDA(-LED:A) ; also sheet 1
SLLED2: SLIDE2.P$LEDA(-LED:A) ; also sheet 1
SLLED3: SLIDE3.P$LEDA(-LED:A) ; also sheet 1
SLLED4: SLIDE4.P$LEDA(-LED:A) ; also sheet 1
SLLED5: SLIDE5.P$LEDA(-LED:A) ; also sheet 1
SLLED6: SLIDE6.P$LEDA(-LED:A) ; also sheet 1
Unconnected: ENV1.3(TIP-SW) ENV2.3(TIP-SW) ENV3.3(TIP-SW) ENV4.3(TIP-SW) ENV5.3(TIP-SW) ENV6.3(TIP-SW) LOCK1.P$1 LOCK1.P$2 LOCK1.P$3 LOCK1.P$4 LOCK2.P$1 LOCK2.P$2 LOCK2.P$3 LOCK2.P$4 LOCK3.P$1 LOCK3.P$2 LOCK3.P$3 LOCK3.P$4 LOCK4.P$1 LOCK4.P$2 LOCK4.P$3 LOCK4.P$4 LOCK5.P$1 LOCK5.P$2 LOCK5.P$3 LOCK5.P$4 LOCK6.P$1 LOCK6.P$2 LOCK6.P$3 LOCK6.P$4

### Notes on the sheet
- Sheet 3: Channel Controls

## Sheet 4 of 6
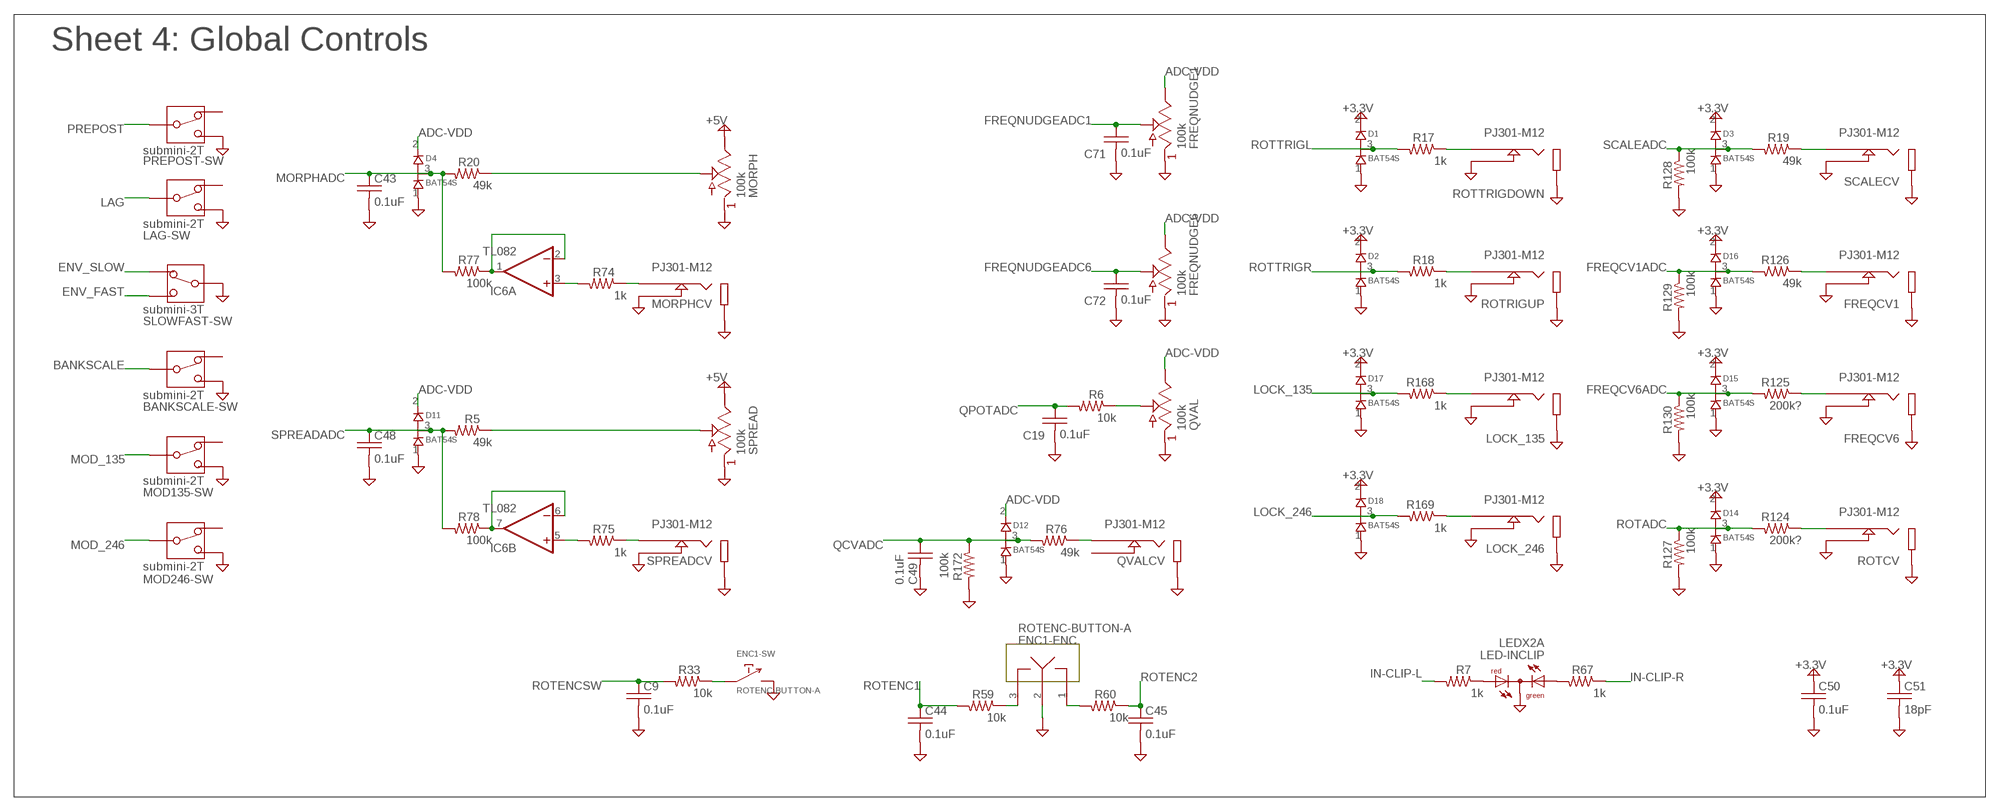
[diagram p3: schematic, sheet 4]

### Parts
BANKSCALE-SW  submini-2T  SPDTT  [SPDT-SUB]
C9  0.1uF  CB  [C0603]
C19  0.1uF  CB  [C0603]
C43  0.1uF  CB  [C0603]
C44  0.1uF  CB  [C0603]
C45  0.1uF  CB  [C0603]
C48  0.1uF  CB  [C0603]
C49  0.1uF  CB  [C0603]
C50  0.1uF  CB  [C0603]
C51  18pF  CB  [C0603]
C71  0.1uF  CB  [C0603]
C72  0.1uF  CB  [C0603]
D1  BAT54S  DIODE-DUAL  [SOT23]
D2  BAT54S  DIODE-DUAL  [SOT23]
D3  BAT54S  DIODE-DUAL  [SOT23]
D4  BAT54S  DIODE-DUAL  [SOT23]
D11  BAT54S  DIODE-DUAL  [SOT23]
D12  BAT54S  DIODE-DUAL  [SOT23]
D14  BAT54S  DIODE-DUAL  [SOT23]
D15  BAT54S  DIODE-DUAL  [SOT23]
D16  BAT54S  DIODE-DUAL  [SOT23]
D17  BAT54S  DIODE-DUAL  [SOT23]
D18  BAT54S  DIODE-DUAL  [SOT23]
ENC1  ROTENC-BUTTON-A  [ROTENC-12MM-BUT]
FREQCV1  PJ301-M12  JACK-MONO-SWM2  [PJ301M-12-FIX]
FREQCV6  PJ301-M12  JACK-MONO-SWM2  [PJ301M-12-FIX]
FREQNUDGE1  100k  POTR0904N  [POT-9MM-SONGHUEI]
FREQNUDGE6  100k  POTR0904N  [POT-9MM-SONGHUEI]
IC6  TL082  OPAMP-2TL072T  [TSSOP8]
LAG-SW  submini-2T  SPDTT  [SPDT-SUB]
LED-INCLIP  LEDX2A  [LED-T1X2]
LOCK_135  PJ301-M12  JACK-MONO-SWM2  [PJ301M-12-FIX]
LOCK_246  PJ301-M12  JACK-MONO-SWM2  [PJ301M-12-FIX]
MOD135-SW  submini-2T  SPDTT  [SPDT-SUB]
MOD246-SW  submini-2T  SPDTT  [SPDT-SUB]
MORPH  100k  POTR0904N  [POT-9MM-SONGHUEI]
MORPHCV  PJ301-M12  JACK-MONO-SWM2  [PJ301M-12-FIX]
PREPOST-SW  submini-2T  SPDTT  [SPDT-SUB]
QVAL  100k  POTR0904N  [POT-9MM-SONGHUEI]
QVALCV  PJ301-M12  JACK-MONO-SWM2  [PJ301M-12-FIX]
R5  49k  RB  [R0603]
R6  10k  RB  [R0603]
R7  1k  RB  [R0603]
R17  1k  RB  [R0603]
R18  1k  RB  [R0603]
R19  49k  RB  [R0603]
R20  49k  RB  [R0603]
R33  10k  RB  [R0603]
R59  10k  RB  [R0603]
R60  10k  RB  [R0603]
R67  1k  RB  [R0603]
R74  1k  RB  [R0603]
R75  1k  RB  [R0603]
R76  49k  RB  [R0603]
R77  100k  RB  [R0603]
R78  100k  RB  [R0603]
R124  200k?  RB  [R0603]
R125  200k?  RB  [R0603]
R126  49k  RB  [R0603]
R127  100k  RB  [R0603]
R128  100k  RB  [R0603]
R129  100k  RB  [R0603]
R130  100k  RB  [R0603]
R168  1k  RB  [R0603]
R169  1k  RB  [R0603]
R172  100k  RB  [R0603]
ROTCV  PJ301-M12  JACK-MONO-SWM2  [PJ301M-12-FIX]
ROTRIGUP  PJ301-M12  JACK-MONO-SWM2  [PJ301M-12-FIX]
ROTTRIGDOWN  PJ301-M12  JACK-MONO-SWM2  [PJ301M-12-FIX]
SCALECV  PJ301-M12  JACK-MONO-SWM2  [PJ301M-12-FIX]
SLOWFAST-SW  submini-3T  SPDTT  [SPDT-SUB]
SPREAD  100k  POTR0904N  [POT-9MM-SONGHUEI]
SPREADCV  PJ301-M12  JACK-MONO-SWM2  [PJ301M-12-FIX]

### Nets
+3.3V [power]: C50.1 C51.1 D1.2(CATHODE) D2.2(CATHODE) D3.2(CATHODE) D14.2(CATHODE) D15.2(CATHODE) D16.2(CATHODE) D17.2(CATHODE) D18.2(CATHODE) ; also sheet 1,2,6
+5V [power]: MORPH.3 SPREAD.3 ; also sheet 3,6
ADC-VDD [power]: D4.2(CATHODE) D11.2(CATHODE) D12.2(CATHODE) FREQNUDGE1.3 FREQNUDGE6.3 QVAL.3 ; also sheet 1,3,6
BANKSCALE: BANKSCALE-SW.P$2 ; also sheet 1
ENV_FAST: SLOWFAST-SW.P$1 ; also sheet 1
ENV_SLOW: SLOWFAST-SW.P$3 ; also sheet 1
FREQCV1ADC: D16.3(COMMON) R126.2 R129.1 ; also sheet 1
FREQCV6ADC: D15.3(COMMON) R125.2 R130.1 ; also sheet 1
FREQNUDGEADC1: C71.1 FREQNUDGE1.2 ; also sheet 1
FREQNUDGEADC6: C72.1 FREQNUDGE6.2 ; also sheet 1
GND [power]: BANKSCALE-SW.P$1 C9.2 C19.2 C43.2 C44.2 C45.2 C48.2 C49.2 C50.2 C51.2 C71.2 C72.2 D1.1(ANODE) D2.1(ANODE) D3.1(ANODE) D4.1(ANODE) D11.1(ANODE) D12.1(ANODE) D14.1(ANODE) D15.1(ANODE) D16.1(ANODE) D17.1(ANODE) D18.1(ANODE) ENC1.2 ENC1.SW2 FREQCV1.2(SLEEVE) FREQCV1.3(TIP-SW) FREQCV6.2(SLEEVE) FREQCV6.3(TIP-SW) FREQNUDGE1.1 FREQNUDGE6.1 LAG-SW.P$1 LED-INCLIP.K-2(C) LOCK_135.2(SLEEVE) LOCK_135.3(TIP-SW) LOCK_246.2(SLEEVE) LOCK_246.3(TIP-SW) MOD135-SW.P$1 MOD246-SW.P$1 MORPH.1 MORPHCV.2(SLEEVE) MORPHCV.3(TIP-SW) PREPOST-SW.P$1 QVAL.1 QVALCV.2(SLEEVE) R127.2 R128.2 R129.2 R130.2 R172.2 ROTCV.2(SLEEVE) ROTCV.3(TIP-SW) ROTRIGUP.2(SLEEVE) ROTRIGUP.3(TIP-SW) ROTTRIGDOWN.2(SLEEVE) ROTTRIGDOWN.3(TIP-SW) SCALECV.2(SLEEVE) SCALECV.3(TIP-SW) SLOWFAST-SW.P$2 SPREAD.1 SPREADCV.2(SLEEVE) SPREADCV.3(TIP-SW) ; also sheet 1,2,3,5,6
IN-CLIP-L: R7.2 ; also sheet 1
IN-CLIP-R: R67.1 ; also sheet 1
LAG: LAG-SW.P$2 ; also sheet 1
LOCK_135: D17.3(COMMON) R168.2 ; also sheet 1
LOCK_246: D18.3(COMMON) R169.2 ; also sheet 1
MOD_135: MOD135-SW.P$2 ; also sheet 1
MOD_246: MOD246-SW.P$2 ; also sheet 1
MORPHADC: C43.1 D4.3(COMMON) R20.2 R77.2 ; also sheet 1
N$1: IC6.3(A:+IN) R74.2
N$2: MORPH.2 R20.1
N$3: IC6.5(B:+IN) R75.2
N$11: QVAL.2 R6.1
N$21: R17.1 ROTTRIGDOWN.1(TIP)
N$22: R18.1 ROTRIGUP.1(TIP)
N$23: R19.1 SCALECV.1(TIP)
N$24: R5.1 SPREAD.2
N$27: ENC1.3 R59.1
N$49: LOCK_135.1(TIP) R168.1
N$56: ENC1.SW1 R33.1
N$57: LOCK_246.1(TIP) R169.1
N$95: LED-INCLIP.A-1(AR) R7.1
N$125: LED-INCLIP.A-3(AG) R67.2
N$143: ENC1.1 R60.2
N$168: MORPHCV.1(TIP) R74.1
N$184: R75.1 SPREADCV.1(TIP)
N$185: QVALCV.1(TIP) R76.1
N$186: IC6.1(A:OUT) IC6.2(A:-IN) R77.1
N$187: IC6.6(B:-IN) IC6.7(B:OUT) R78.1
N$220: R124.1 ROTCV.1(TIP)
N$221: FREQCV6.1(TIP) R125.1
N$222: FREQCV1.1(TIP) R126.1
PREPOST: PREPOST-SW.P$2 ; also sheet 1
QCVADC: C49.1 D12.3(COMMON) R76.2 R172.1 ; also sheet 1
QPOTADC: C19.1 R6.2 ; also sheet 1
ROTADC: D14.3(COMMON) R124.2 R127.1 ; also sheet 1
ROTENC1: C44.1 R59.2 ; also sheet 1
ROTENC2: C45.1 R60.1 ; also sheet 1
ROTENCSW: C9.1 R33.2 ; also sheet 1
ROTTRIGL: D1.3(COMMON) R17.2 ; also sheet 1
ROTTRIGR: D2.3(COMMON) R18.2 ; also sheet 1
SCALEADC: D3.3(COMMON) R19.2 R128.1 ; also sheet 1
SPREADADC: C48.1 D11.3(COMMON) R5.2 R78.2 ; also sheet 1
Unconnected: BANKSCALE-SW.P$3 LAG-SW.P$3 MOD135-SW.P$3 MOD246-SW.P$3 PREPOST-SW.P$3 QVALCV.3(TIP-SW)

### Notes on the sheet
- Sheet 4: Global Controls

## Sheet 5 of 6
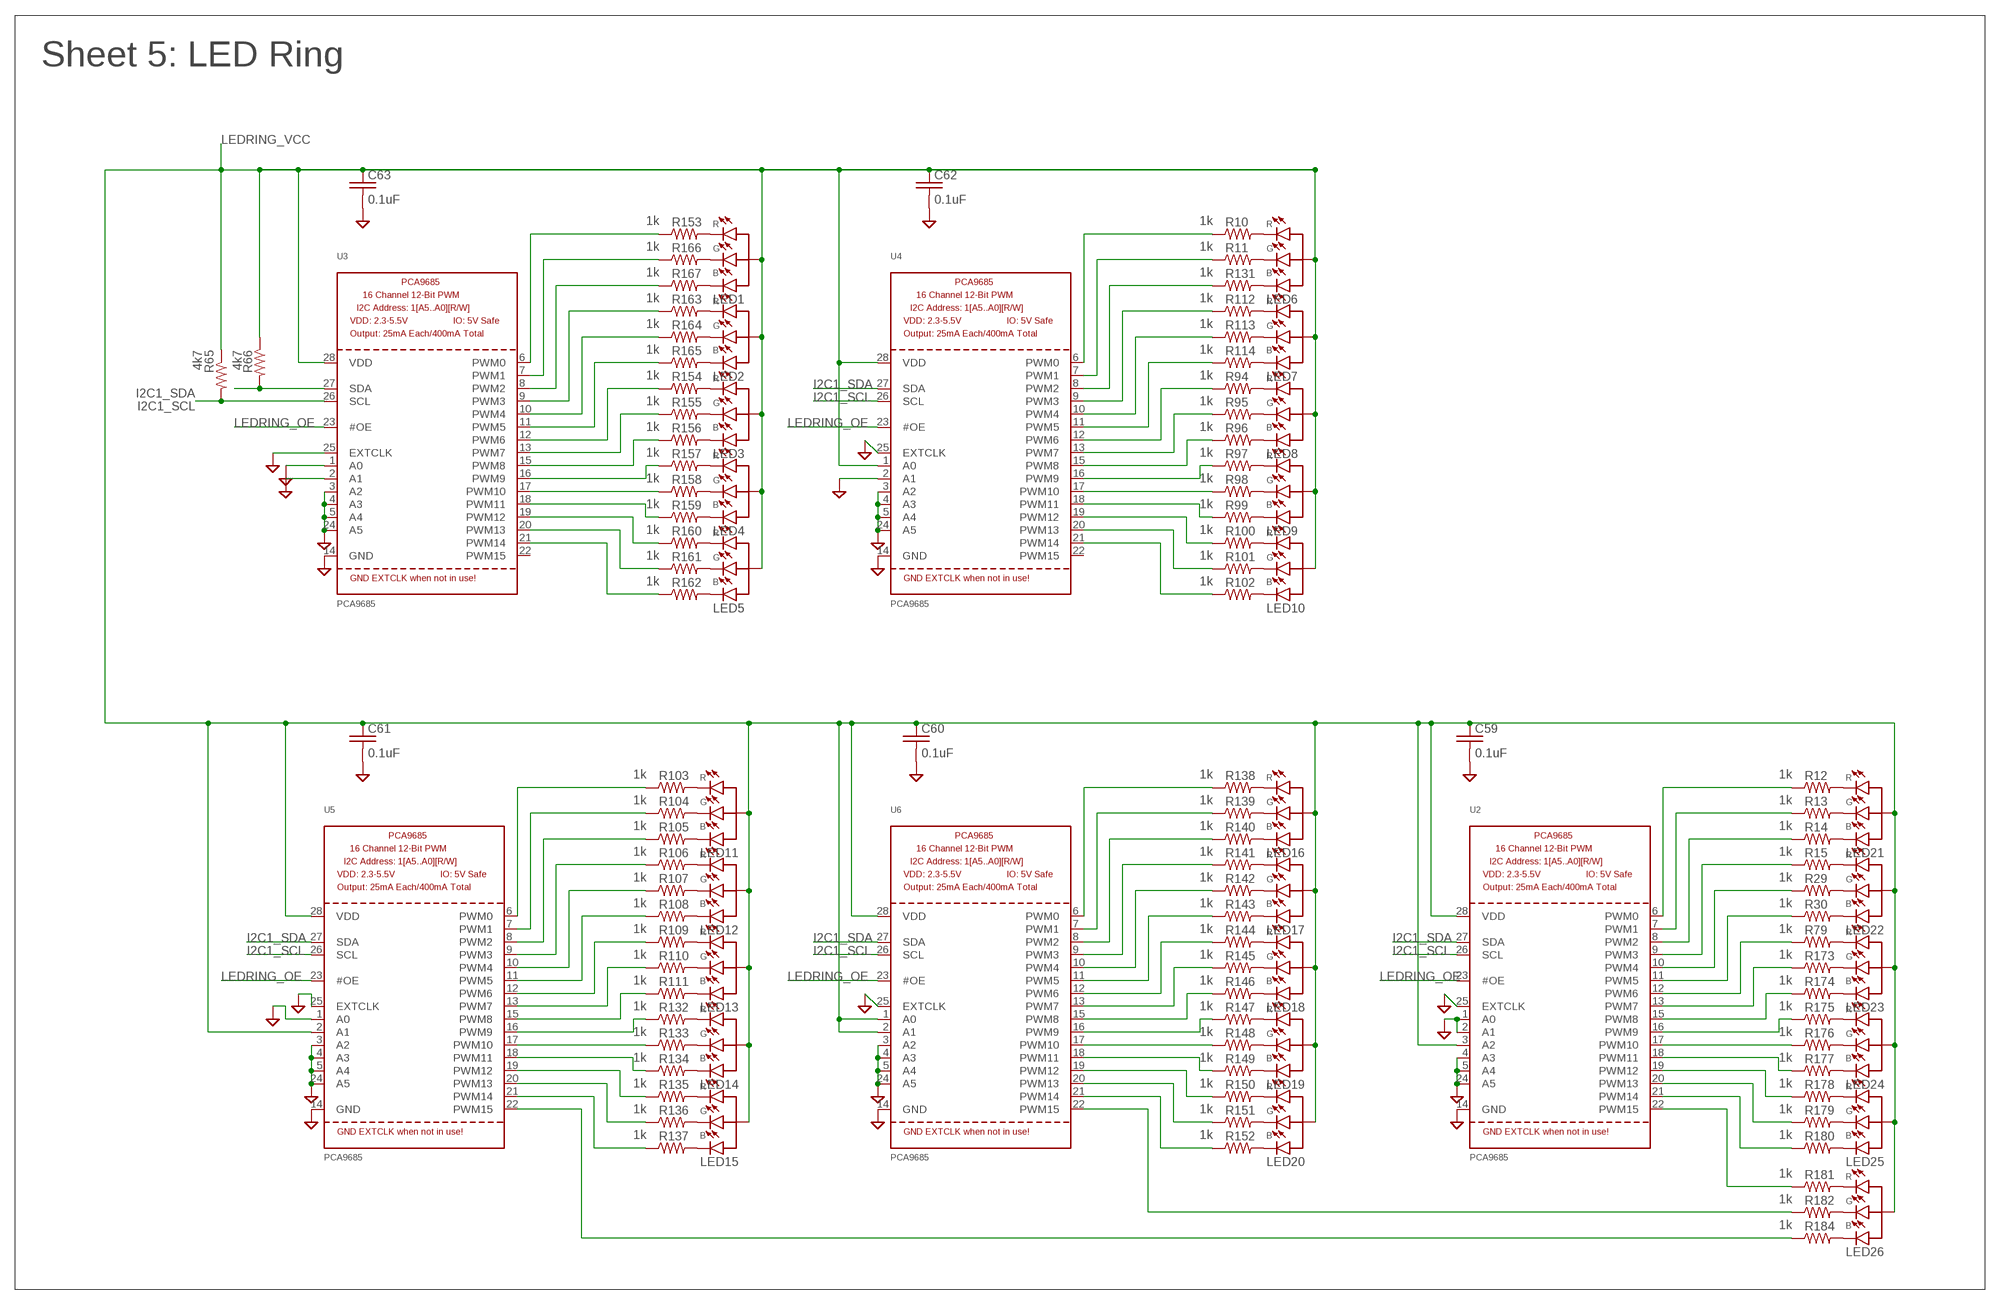
[diagram p4: schematic, sheet 5]

### Parts
C59  0.1uF  CB  [C0603]
C60  0.1uF  CB  [C0603]
C61  0.1uF  CB  [C0603]
C62  0.1uF  CB  [C0603]
C63  0.1uF  CB  [C0603]
LED1  LED-RGB-CA-HEBEI  [PLCC4]
LED2  LED-RGB-CA-HEBEI  [PLCC4]
LED3  LED-RGB-CA-HEBEI  [PLCC4]
LED4  LED-RGB-CA-HEBEI  [PLCC4]
LED5  LED-RGB-CA-HEBEI  [PLCC4]
LED6  LED-RGB-CA-HEBEI  [PLCC4]
LED7  LED-RGB-CA-HEBEI  [PLCC4]
LED8  LED-RGB-CA-HEBEI  [PLCC4]
LED9  LED-RGB-CA-HEBEI  [PLCC4]
LED10  LED-RGB-CA-HEBEI  [PLCC4]
LED11  LED-RGB-CA-HEBEI  [PLCC4]
LED12  LED-RGB-CA-HEBEI  [PLCC4]
LED13  LED-RGB-CA-HEBEI  [PLCC4]
LED14  LED-RGB-CA-HEBEI  [PLCC4]
LED15  LED-RGB-CA-HEBEI  [PLCC4]
LED16  LED-RGB-CA-HEBEI  [PLCC4]
LED17  LED-RGB-CA-HEBEI  [PLCC4]
LED18  LED-RGB-CA-HEBEI  [PLCC4]
LED19  LED-RGB-CA-HEBEI  [PLCC4]
LED20  LED-RGB-CA-HEBEI  [PLCC4]
LED21  LED-RGB-CA-HEBEI  [PLCC4]
LED22  LED-RGB-CA-HEBEI  [PLCC4]
LED23  LED-RGB-CA-HEBEI  [PLCC4]
LED24  LED-RGB-CA-HEBEI  [PLCC4]
LED25  LED-RGB-CA-HEBEI  [PLCC4]
LED26  LED-RGB-CA-HEBEI  [PLCC4]
R10  1k  RB  [R0603]
R11  1k  RB  [R0603]
R12  1k  RB  [R0603]
R13  1k  RB  [R0603]
R14  1k  RB  [R0603]
R15  1k  RB  [R0603]
R29  1k  RB  [R0603]
R30  1k  RB  [R0603]
R65  4k7  RB  [R0603]
R66  4k7  RB  [R0603]
R79  1k  RB  [R0603]
R94  1k  RB  [R0603]
R95  1k  RB  [R0603]
R96  1k  RB  [R0603]
R97  1k  RB  [R0603]
R98  1k  RB  [R0603]
R99  1k  RB  [R0603]
R100  1k  RB  [R0603]
R101  1k  RB  [R0603]
R102  1k  RB  [R0603]
R103  1k  RB  [R0603]
R104  1k  RB  [R0603]
R105  1k  RB  [R0603]
R106  1k  RB  [R0603]
R107  1k  RB  [R0603]
R108  1k  RB  [R0603]
R109  1k  RB  [R0603]
R110  1k  RB  [R0603]
R111  1k  RB  [R0603]
R112  1k  RB  [R0603]
R113  1k  RB  [R0603]
R114  1k  RB  [R0603]
R131  1k  RB  [R0603]
R132  1k  RB  [R0603]
R133  1k  RB  [R0603]
R134  1k  RB  [R0603]
R135  1k  RB  [R0603]
R136  1k  RB  [R0603]
R137  1k  RB  [R0603]
R138  1k  RB  [R0603]
R139  1k  RB  [R0603]
R140  1k  RB  [R0603]
R141  1k  RB  [R0603]
R142  1k  RB  [R0603]
R143  1k  RB  [R0603]
R144  1k  RB  [R0603]
R145  1k  RB  [R0603]
R146  1k  RB  [R0603]
R147  1k  RB  [R0603]
R148  1k  RB  [R0603]
R149  1k  RB  [R0603]
R150  1k  RB  [R0603]
R151  1k  RB  [R0603]
R152  1k  RB  [R0603]
R153  1k  RB  [R0603]
R154  1k  RB  [R0603]
R155  1k  RB  [R0603]
R156  1k  RB  [R0603]
R157  1k  RB  [R0603]
R158  1k  RB  [R0603]
R159  1k  RB  [R0603]
R160  1k  RB  [R0603]
R161  1k  RB  [R0603]
R162  1k  RB  [R0603]
R163  1k  RB  [R0603]
R164  1k  RB  [R0603]
R165  1k  RB  [R0603]
R166  1k  RB  [R0603]
R167  1k  RB  [R0603]
R173  1k  RB  [R0603]
R174  1k  RB  [R0603]
R175  1k  RB  [R0603]
R176  1k  RB  [R0603]
R177  1k  RB  [R0603]
R178  1k  RB  [R0603]
R179  1k  RB  [R0603]
R180  1k  RB  [R0603]
R181  1k  RB  [R0603]
R182  1k  RB  [R0603]
R184  1k  RB  [R0603]
U2  PCA9685  [TSSOP28]
U3  PCA9685  [TSSOP28]
U4  PCA9685  [TSSOP28]
U5  PCA9685  [TSSOP28]
U6  PCA9685  [TSSOP28]

### Nets
GND [power]: C59.2 C60.2 C61.2 C62.2 C63.2 U2.1(A0) U2.2(A1) U2.4(A3) U2.5(A4) U2.14(GND) U2.24(A5) U2.25(EXTCLK) U3.1(A0) U3.2(A1) U3.3(A2) U3.4(A3) U3.5(A4) U3.14(GND) U3.24(A5) U3.25(EXTCLK) U4.2(A1) U4.3(A2) U4.4(A3) U4.5(A4) U4.14(GND) U4.24(A5) U4.25(EXTCLK) U5.1(A0) U5.3(A2) U5.4(A3) U5.5(A4) U5.14(GND) U5.24(A5) U5.25(EXTCLK) U6.3(A2) U6.4(A3) U6.5(A4) U6.14(GND) U6.24(A5) U6.25(EXTCLK) ; also sheet 1,2,3,4,6
I2C1_SCL: R65.2 U2.26(SCL) U3.26(SCL) U4.26(SCL) U5.26(SCL) U6.26(SCL) ; also sheet 1
I2C1_SDA: R66.2 U2.27(SDA) U3.27(SDA) U4.27(SDA) U5.27(SDA) U6.27(SDA) ; also sheet 1
LEDRING_OE: U2.23(#OE) U3.23(#OE) U4.23(#OE) U5.23(#OE) U6.23(#OE) ; also sheet 1
LEDRING_VCC: C59.1 C60.1 C61.1 C62.1 C63.1 LED1.P$2(A) LED2.P$2(A) LED3.P$2(A) LED4.P$2(A) LED5.P$2(A) LED6.P$2(A) LED7.P$2(A) LED8.P$2(A) LED9.P$2(A) LED10.P$2(A) LED11.P$2(A) LED12.P$2(A) LED13.P$2(A) LED14.P$2(A) LED15.P$2(A) LED16.P$2(A) LED17.P$2(A) LED18.P$2(A) LED19.P$2(A) LED20.P$2(A) LED21.P$2(A) LED22.P$2(A) LED23.P$2(A) LED24.P$2(A) LED25.P$2(A) LED26.P$2(A) R65.1 R66.1 U2.3(A2) U2.28(VDD) U3.28(VDD) U4.1(A0) U4.28(VDD) U5.2(A1) U5.28(VDD) U6.1(A0) U6.2(A1) U6.28(VDD) ; also sheet 6
N$5: LED1.P$1(CR) R153.2
N$6: LED1.P$4(CG) R166.2
N$15: R12.1 U2.6(PWM0)
N$16: R13.1 U2.7(PWM1)
N$17: R14.1 U2.8(PWM2)
N$18: R15.1 U2.9(PWM3)
N$20: LED1.P$3(CB) R167.2
N$25: R29.1 U2.10(PWM4)
N$26: R30.1 U2.11(PWM5)
N$42: LED2.P$1(CR) R163.2
N$43: LED2.P$4(CG) R164.2
N$44: LED2.P$3(CB) R165.2
N$45: LED3.P$1(CR) R154.2
N$46: LED3.P$4(CG) R155.2
N$47: LED3.P$3(CB) R156.2
N$48: LED4.P$1(CR) R157.2
N$50: LED4.P$4(CG) R158.2
N$51: LED4.P$3(CB) R159.2
N$52: R79.1 U2.12(PWM6)
N$54: R173.1 U2.13(PWM7)
N$55: R174.1 U2.15(PWM8)
N$59: LED5.P$1(CR) R160.2
N$60: LED5.P$4(CG) R161.2
N$61: LED5.P$3(CB) R162.2
N$63: LED6.P$1(CR) R10.2
N$64: LED6.P$4(CG) R11.2
N$71: LED6.P$3(CB) R131.2
N$72: LED7.P$1(CR) R112.2
N$73: LED7.P$4(CG) R113.2
N$74: LED7.P$3(CB) R114.2
N$75: LED8.P$1(CR) R94.2
N$76: LED8.P$4(CG) R95.2
N$77: LED8.P$3(CB) R96.2
N$78: LED9.P$1(CR) R97.2
N$79: LED9.P$4(CG) R98.2
N$80: LED9.P$3(CB) R99.2
N$81: LED10.P$1(CR) R100.2
N$82: LED10.P$4(CG) R101.2
N$83: LED10.P$3(CB) R102.2
N$84: LED11.P$1(CR) R103.2
N$85: R175.1 U2.16(PWM9)
N$86: LED11.P$4(CG) R104.2
N$87: LED11.P$3(CB) R105.2
N$88: LED12.P$1(CR) R106.2
N$89: LED12.P$4(CG) R107.2
N$90: LED12.P$3(CB) R108.2
N$91: LED13.P$1(CR) R109.2
N$92: LED13.P$4(CG) R110.2
N$93: LED14.P$1(CR) R132.2
N$94: LED14.P$4(CG) R133.2
N$97: LED14.P$3(CB) R134.2
N$98: LED15.P$1(CR) R135.2
N$99: LED15.P$4(CG) R136.2
N$100: R176.1 U2.17(PWM10)
N$101: R177.1 U2.18(PWM11)
N$103: LED15.P$3(CB) R137.2
N$129: LED16.P$1(CR) R138.2
N$133: LED16.P$4(CG) R139.2
N$137: LED16.P$3(CB) R140.2
N$142: LED17.P$1(CR) R141.2
N$151: LED17.P$4(CG) R142.2
N$152: LED17.P$3(CB) R143.2
N$153: LED18.P$1(CR) R144.2
N$154: LED18.P$4(CG) R145.2
N$155: LED18.P$3(CB) R146.2
N$156: LED19.P$1(CR) R147.2
N$157: LED19.P$4(CG) R148.2
N$158: LED19.P$3(CB) R149.2
N$159: LED20.P$1(CR) R150.2
N$160: LED20.P$4(CG) R151.2
N$161: LED20.P$3(CB) R152.2
N$162: LED13.P$3(CB) R111.2
N$169: R153.1 U3.6(PWM0)
N$170: R166.1 U3.7(PWM1)
N$171: R167.1 U3.8(PWM2)
N$172: R163.1 U3.9(PWM3)
N$173: R164.1 U3.10(PWM4)
N$174: R165.1 U3.11(PWM5)
N$175: R154.1 U3.12(PWM6)
N$176: R155.1 U3.13(PWM7)
N$177: R156.1 U3.15(PWM8)
N$178: R157.1 U3.16(PWM9)
N$179: R158.1 U3.17(PWM10)
N$180: R159.1 U3.18(PWM11)
N$181: R160.1 U3.19(PWM12)
N$182: R161.1 U3.20(PWM13)
N$183: R162.1 U3.21(PWM14)
N$188: R178.1 U2.19(PWM12)
N$196: R10.1 U4.6(PWM0)
N$197: R11.1 U4.7(PWM1)
N$198: R131.1 U4.8(PWM2)
N$199: R112.1 U4.9(PWM3)
N$200: R113.1 U4.10(PWM4)
N$201: R114.1 U4.11(PWM5)
N$202: R94.1 U4.12(PWM6)
N$203: R95.1 U4.13(PWM7)
N$204: R96.1 U4.15(PWM8)
N$205: R97.1 U4.16(PWM9)
N$206: R98.1 U4.17(PWM10)
N$207: R99.1 U4.18(PWM11)
N$208: R100.1 U4.19(PWM12)
N$209: R101.1 U4.20(PWM13)
N$210: R102.1 U4.21(PWM14)
N$225: R179.1 U2.20(PWM13)
N$226: R103.1 U5.6(PWM0)
N$227: R104.1 U5.7(PWM1)
N$228: R105.1 U5.8(PWM2)
N$229: R106.1 U5.9(PWM3)
N$230: R107.1 U5.10(PWM4)
N$231: R108.1 U5.11(PWM5)
N$232: R109.1 U5.12(PWM6)
N$233: R110.1 U5.13(PWM7)
N$234: R111.1 U5.15(PWM8)
N$235: R132.1 U5.16(PWM9)
N$236: R133.1 U5.17(PWM10)
N$237: R134.1 U5.18(PWM11)
N$238: R135.1 U5.19(PWM12)
N$239: R136.1 U5.20(PWM13)
N$240: R137.1 U5.21(PWM14)
N$242: R180.1 U2.21(PWM14)
N$243: LED21.P$1(CR) R12.2
N$244: LED21.P$4(CG) R13.2
N$245: LED21.P$3(CB) R14.2
N$246: LED22.P$1(CR) R15.2
N$247: LED22.P$4(CG) R29.2
N$248: LED22.P$3(CB) R30.2
N$249: LED23.P$1(CR) R79.2
N$250: LED23.P$4(CG) R173.2
N$251: LED23.P$3(CB) R174.2
N$252: LED24.P$1(CR) R175.2
N$253: LED24.P$4(CG) R176.2
N$255: LED24.P$3(CB) R177.2
N$256: R138.1 U6.6(PWM0)
N$257: R139.1 U6.7(PWM1)
N$258: R140.1 U6.8(PWM2)
N$259: R141.1 U6.9(PWM3)
N$260: R142.1 U6.10(PWM4)
N$261: R143.1 U6.11(PWM5)
N$262: R144.1 U6.12(PWM6)
N$263: R145.1 U6.13(PWM7)
N$264: R146.1 U6.15(PWM8)
N$265: R147.1 U6.16(PWM9)
N$266: R148.1 U6.17(PWM10)
N$267: R149.1 U6.18(PWM11)
N$268: R150.1 U6.19(PWM12)
N$269: R151.1 U6.20(PWM13)
N$270: R152.1 U6.21(PWM14)
N$271: LED25.P$1(CR) R178.2
N$272: LED25.P$4(CG) R179.2
N$275: LED25.P$3(CB) R180.2
N$276: LED26.P$1(CR) R181.2
N$277: LED26.P$4(CG) R182.2
N$278: LED26.P$3(CB) R184.2
N$279: R181.1 U2.22(PWM15)
N$280: R182.1 U6.22(PWM15)
N$281: R184.1 U5.22(PWM15)
Unconnected: U3.22(PWM15) U4.22(PWM15)

### Notes on the sheet
- Sheet 5: LED Ring

## Sheet 6 of 6
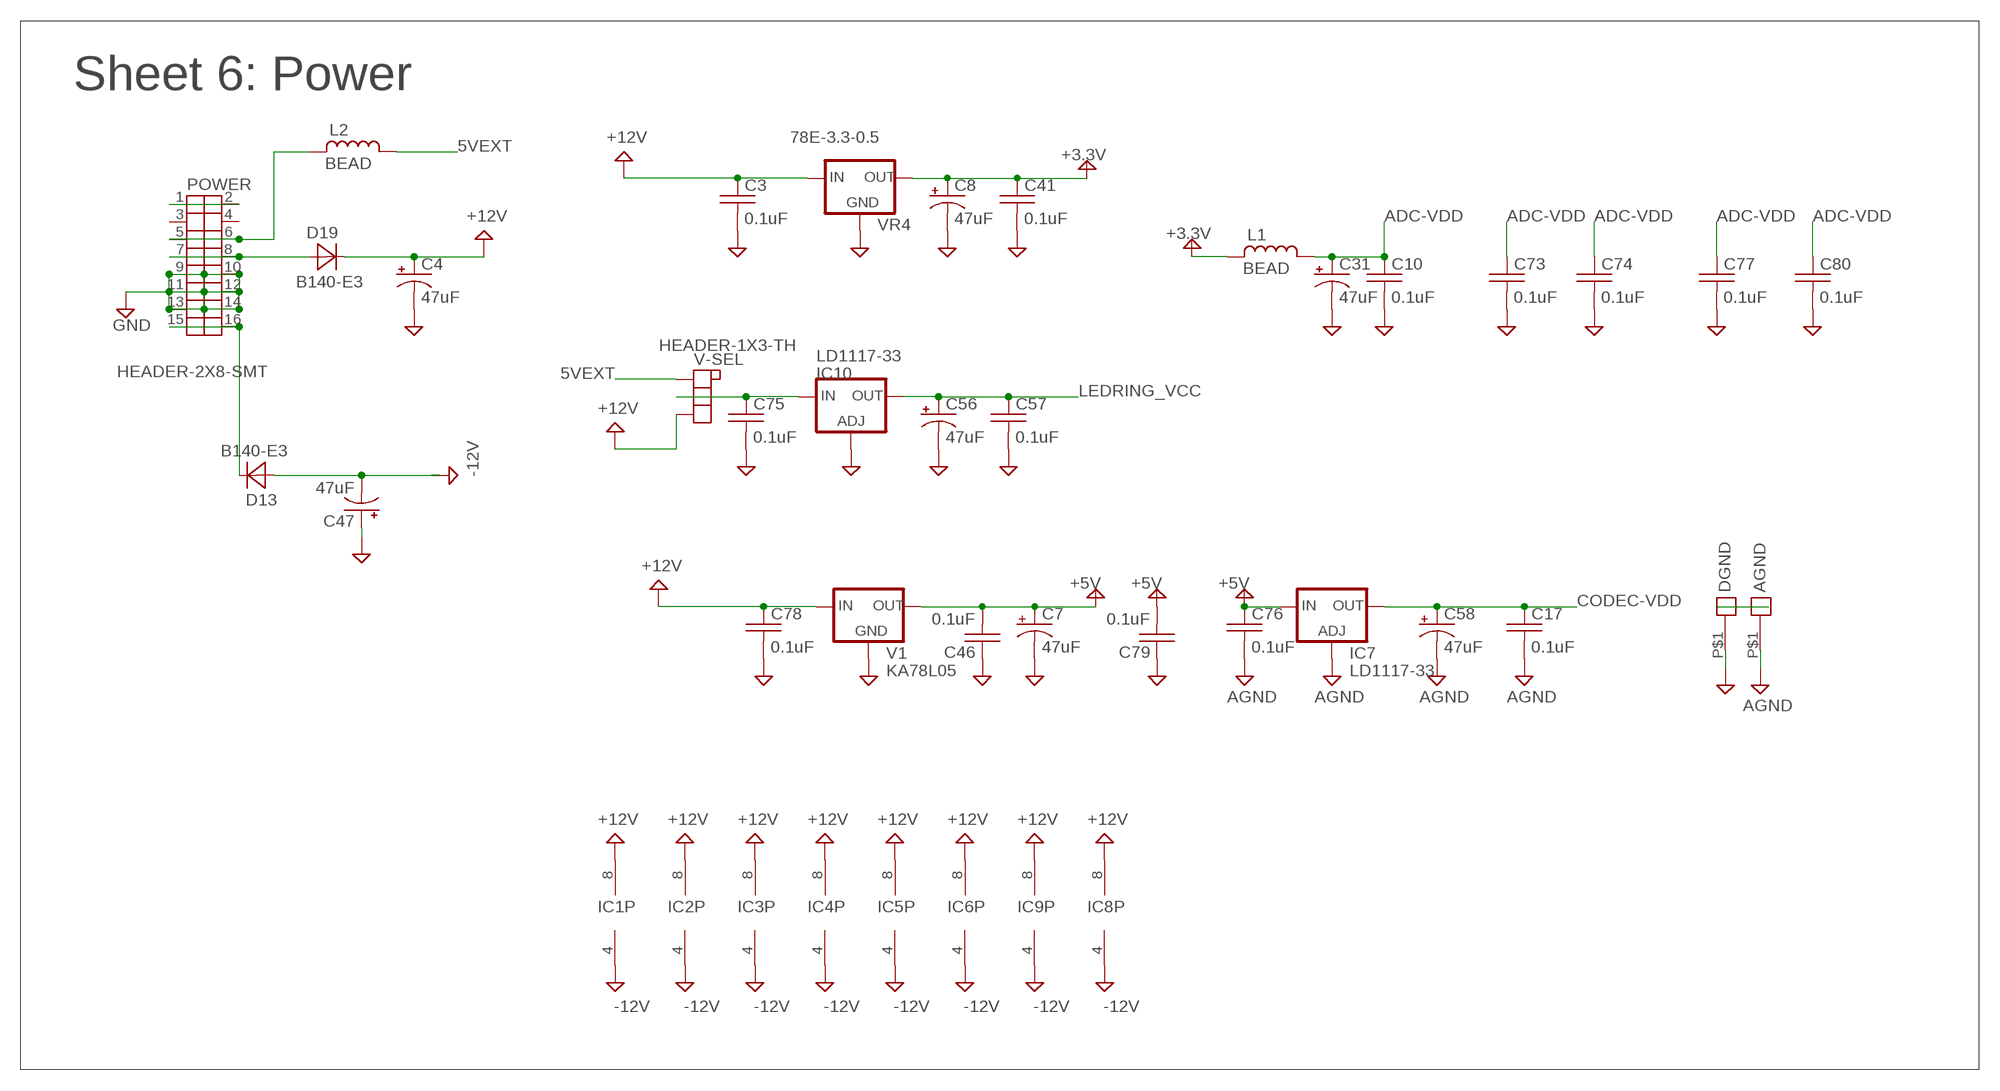
[diagram p5: schematic, sheet 6]

### Parts
AGND  PAD-06  [PAD-06]
C3  0.1uF  CB  [C0603]
C4  47uF  C-POL5  [C-POL-5]
C7  47uF  C-POL5  [C-POL-5]
C8  47uF  C-POL5  [C-POL-5]
C10  0.1uF  CB  [C0603]
C17  0.1uF  CB  [C0603]
C31  47uF  C-POL5  [C-POL-5]
C41  0.1uF  CB  [C0603]
C46  0.1uF  CB  [C0603]
C47  47uF  C-POL5  [C-POL-5]
C56  47uF  C-POL5  [C-POL-5]
C57  0.1uF  CB  [C0603]
C58  47uF  C-POL5  [C-POL-5]
C73  0.1uF  CB  [C0603]
C74  0.1uF  CB  [C0603]
C75  0.1uF  CB  [C0603]
C76  0.1uF  CB  [C0603]
C77  0.1uF  CB  [C0603]
C78  0.1uF  CB  [C0603]
C79  0.1uF  CB  [C0603]
C80  0.1uF  CB  [C0603]
D13  B140-E3  DA  [SMA]
D19  B140-E3  DA  [SMA]
DGND  PAD-06  [PAD-06]
IC7  LD1117-33  LD111750TRS  [SOT223]
IC10  LD1117-33  LD111750TRS  [SOT223]
L1  BEAD  LB  [0603]
L2  BEAD  LB  [0603]
POWER  HEADER-2X8-SMT  HEADER-2X8SHRD  [HEADER-2X8-SMT-SHROUDED]
V1  KA78L05  VREG-KA78LXX  [SOT89]
V-SEL  HEADER-1X3-TH  HEADER-1X3  [HEADER-1X3-TH]
VR4  78E-3.3-0.5  VREG-DCDC  [RECOM-DCDC]

### Nets
5VEXT: L2.2 V-SEL.P$1
+3.3V [power]: C8.+ C41.1 L1.1 VR4.P$3(OUT) ; also sheet 1,2,4
+5V [power]: C7.+ C46.2 C76.1 C79.2 IC7.3(IN) V1.1(OUT) ; also sheet 3,4
+12V: C3.1 C4.+ C78.1 D19.K(C) IC1.8(P:V+) IC2.8(P:V+) IC3.8(P:V+) IC4.8(P:V+) IC5.8(P:V+) IC6.8(P:V+) IC8.8(P:V+) IC9.8(P:V+) V1.3(IN) V-SEL.P$3 VR4.P$1(IN)
-12V: C47.- D13.A IC1.4(P:V-) IC2.4(P:V-) IC3.4(P:V-) IC4.4(P:V-) IC5.4(P:V-) IC6.4(P:V-) IC8.4(P:V-) IC9.4(P:V-)
ADC-VDD [power]: C10.1 C31.+ C73.1 C74.1 C77.1 C80.1 L1.2 ; also sheet 1,3,4
AGND: AGND.P$1 C17.2 C58.- C76.2 IC7.1(ADJ) ; also sheet 2
CODEC-VDD [power]: C17.1 C58.+ IC7.2(OUT) IC7.4(OUT) ; also sheet 2
GND [power]: C3.2 C4.- C7.- C8.- C10.2 C31.- C41.2 C46.1 C47.+ C56.- C57.2 C73.2 C74.2 C75.2 C77.2 C78.2 C79.1 C80.2 DGND.P$1 IC10.1(ADJ) POWER.9 POWER.10 POWER.11 POWER.12 POWER.13 POWER.14 V1.2A(GND) V1.2B(GND) VR4.P$2(GND) ; also sheet 1,2,3,4,5
LEDRING_VCC: C56.+ C57.1 IC10.2(OUT) IC10.4(OUT) ; also sheet 5
N$58: C75.1 IC10.3(IN) V-SEL.P$2
N$147: L2.1 POWER.5 POWER.6
N$148: D19.A POWER.7 POWER.8
N$273: D13.K(C) POWER.15 POWER.16
N$274: POWER.1 POWER.2
Unconnected: POWER.3 POWER.4

### Notes on the sheet
- Sheet 6: Power

## Library data of the parts
AGND AGND-OPT DGND PG2 PG3 PG5 PG6 = 4ms-main-parts:PAD
BANDCV1-BANDCV6 ENV1-ENV6 FREQCV1 FREQCV6 IN-1 IN-2 LOCK_135 LOCK_246 MORPHCV OUT-1 OUT-2 QVALCV ROTCV ROTRIGUP ROTTRIGDOWN SCALECV SPREADCV = 4ms-main-parts:JACK-MONO-SW
BANKSCALE-SW LAG-SW MOD135-SW MOD246-SW PREPOST-SW SLOWFAST-SW = malekko main:SPDT: SPDT Switch
C1-C3 C5 C6 C9-C20 C22-C30 C32-C46 C48-C55 C57 C59-C80 = 4ms-main-parts:C: Non-Polarized Capacitor
C4 C7 C8 C21 C31 C47 C56 C58 = malekko main:C-POL: Polarized Capacitor
D1-D12 D14-D18 = 4ms-main-parts:DIODE-DUAL: ON Semi BAT54SLT1G Max Reverse Voltage: 30V Max Power Dissipation: 225mW Max Forward Current: 200mA Vdrop at 1mA, 25°C: 320mV Vdrop at 10mA: 400mV
D13 D19 = malekko main:D: Diode
ENC1 = 4ms-main-parts:ROTENC-BUTTON
FREQNUDGE1 FREQNUDGE6 MORPH QVAL SPREAD = 4ms-main-parts:POT: PVZA: Murata series PVZ3A471C01R00 9MM POT SONGHUEI: Part number R0904N-B##VALUE## 16MM ALPHA: Part number RV16AF-4A-###
IC1-IC6 IC8 IC9 = malekko main:OPAMP-2: Dual OPAMP
IC7 IC10 = 4ms-main-parts:LD1117: Low drop fixed and adjustable positive voltage regulators 1 A Source: http://www.st.com/stonline/products/literature/ds/7194/ld1117axx.pdf
L1 L2 = 4ms-main-parts:L: Inductor; MOUSER: 875-MI0603K300R-10
LED1-LED26 = 4ms-main-parts:LED-RGB-CA: Hebei I.T. (Shanghai) PLCC4RGBCT-CA
LED-INCLIP = malekko main:LEDX2: Dual LED, Common Cathode
LOCK1-LOCK6 = 4ms-main-parts:BUTTON-LED
POWER = 4ms-main-parts:HEADER-2X8: SMT HEADER 2x8 Unshrouded: Cixi Langling LL1010-5C (HI TEMP 2*8PIN) Shrouded: Cixi Langling LL1007-3 (2*8PIN)
R1-R8 R16 R20 R25 R26 R31 R34-R37 R51 R53 R55 R57 R61-R78 R80-R93 R115 R116 R172 R183 R185-R191 R194 = malekko main:R: Resistor
R9-R15 R17-R19 R21-R24 R27-R30 R32 R33 R38-R50 R52 R54 R56 R58-R60 R79 R94-R114 R117-R169 R173-R182 R184 = 4ms-main-parts:R: Resistor
S0 S1 = 4ms-main-parts:BUTTON-TACT
SLIDE1-SLIDE6 = 4ms-main-parts:POT-LED
SWD = 4ms-main-parts:HEADER-1X4
U1 = 4ms-main-parts:WM8731
U2-U6 = adafruit:PCA9685: PCA9685 - 16 Channel 12-Bit I2C PWM Controller 5.0V tolerant 16 channel, 12-bit I2C PWM controller with 25mA per output (max. 400mA total) Digikey: 568-5931-1-ND
U7 = 4ms-main-parts:STM32F429Z
U$1 = SparkFun-Connectors:USB-MINIB: Samtec MUSB-05-F-B-SM-A Mini-USB "B" connector with 5th pin broken out. Created new symbol breaking out 5th "ID" pin in mini/micro USB connector spec. See: http://en.wikipedia.org/wiki/Mini_usb#Cables. Uses same footprint as 4-pin symbol. Also added pins to connect to mounting / shield pads if required (probably not generally needed as signals aren't shielded once they leave the connector).
V1 VR4 = 4ms-main-parts:VREG
V-SEL = 4ms-main-parts:HEADER-1X3: Male or Female Header 1x3 (35mil holes fits most square pins)
X1 = 4ms-main-parts:CRYSTAL: Crystal FA-238 could be Epson Timing #Q22FA2380xxxx00 (FA-238 16.0000MB or TSX-3225 16.0000MF10U-B0) Also matches footprint TSX-3225

## Net classes
1 power: width 0.178 mm, drill 0.305 mm, clearance 0.178 mm to class 0, clearance 0.178 mm